# Altium project Genio350_DevKit.PrjPcb (part 2 of 3)

## Sheet LPDDR4X_Channel_A.SchDoc
size A4; SheetNumber: 14; SheetTotal: 36
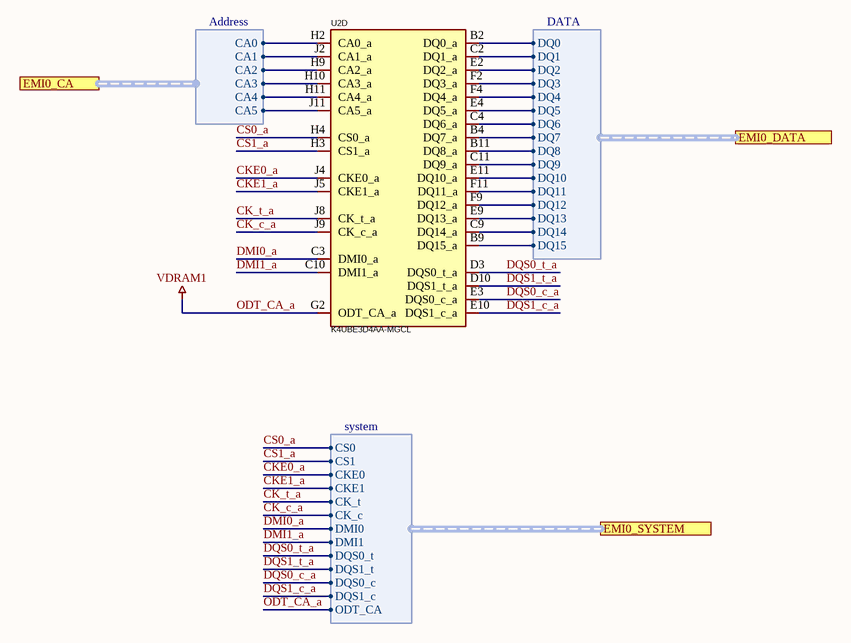
[diagram p11: LPDDR4X_Channel_A.SchDoc]

### Parts
U2  K4UBE3D4AA-MGCL  [K4F8E304HB-MGCJ]  (part D of 5)

### Ports
EMI0_CA (harness Address, see LPDDR4X[6000,9400], LPDDR4X[7000,9400], MT8365[2420,6400], MT8365_DDR4X[7500,5500]), EMI0_DATA (harness DATA, see LPDDR4X[6000,9820], LPDDR4X[7000,9820], MT8365[2294.4,6800], MT8365_DDR4X[7800,9200]), EMI0_SYSTEM (harness system, see LPDDR4X[6000,8860], LPDDR4X[7000,8860], MT8365[2200,5960], MT8365_DDR4X[8200,3000])

### Harnesses
DATA: DQ0, DQ1, DQ2, DQ3, DQ4, DQ5, DQ6, DQ7, DQ8, DQ9, DQ10, DQ11, DQ12, DQ13, DQ14, DQ15
Address: CA0, CA1, CA2, CA3, CA4, CA5
system: CS0, CS1, CKE0, CKE1, CK_t, CK_c, DMI0, DMI1, DQS0_t, DQS1_t, DQS0_c, DQS1_c, ODT_CA

### Nets
ODT_CA_a: U2.G2(ODT_CA_a) ; port EMI0_SYSTEM.ODT_CA  [also labelled VDRAM1]
CK_c_a: U2.J9(CK_c_a) ; port EMI0_SYSTEM.CK_c
CK_t_a: U2.J8(CK_t_a) ; port EMI0_SYSTEM.CK_t
CKE0_a: U2.J4(CKE0_a) ; port EMI0_SYSTEM.CKE0
CKE1_a: U2.J5(CKE1_a) ; port EMI0_SYSTEM.CKE1
CS0_a: U2.H4(CS0_a) ; port EMI0_SYSTEM.CS0
CS1_a: U2.H3(CS1_a) ; port EMI0_SYSTEM.CS1
DMI0_a: U2.C3(DMI0_a) ; port EMI0_SYSTEM.DMI0
DMI1_a: U2.C10(DMI1_a) ; port EMI0_SYSTEM.DMI1
DQS0_c_a: U2.E3(DQS0_c_a) ; port EMI0_SYSTEM.DQS0_c
DQS0_t_a: U2.D3(DQS0_t_a) ; port EMI0_SYSTEM.DQS0_t
DQS1_c_a: U2.E10(DQS1_c_a) ; port EMI0_SYSTEM.DQS1_c
DQS1_t_a: U2.D10(DQS1_t_a) ; port EMI0_SYSTEM.DQS1_t
EMI0_A3: U2.H11(CA4_a) ; port EMI0_CA.CA4
EMI0_A4: U2.H10(CA3_a) ; port EMI0_CA.CA3
EMI0_A12: U2.H9(CA2_a) ; port EMI0_CA.CA2
EMI0_ACT_N: U2.J2(CA1_a) ; port EMI0_CA.CA1
EMI0_BA0: U2.J11(CA5_a) ; port EMI0_CA.CA5
EMI0_DQ0: U2.E2(DQ2_a) ; port EMI0_DATA.DQ2
EMI0_DQ1: U2.B11(DQ8_a) ; port EMI0_DATA.DQ8
EMI0_DQ2: U2.E4(DQ5_a) ; port EMI0_DATA.DQ5
EMI0_DQ3: U2.E11(DQ10_a) ; port EMI0_DATA.DQ10
EMI0_DQ4: U2.F2(DQ3_a) ; port EMI0_DATA.DQ3
EMI0_DQ5: U2.C11(DQ9_a) ; port EMI0_DATA.DQ9
EMI0_DQ6: U2.F4(DQ4_a) ; port EMI0_DATA.DQ4
EMI0_DQ7: U2.F11(DQ11_a) ; port EMI0_DATA.DQ11
EMI0_DQ8: U2.B4(DQ7_a) ; port EMI0_DATA.DQ7
EMI0_DQ9: U2.F9(DQ12_a) ; port EMI0_DATA.DQ12
EMI0_DQ10: U2.C4(DQ6_a) ; port EMI0_DATA.DQ6
EMI0_DQ11: U2.E9(DQ13_a) ; port EMI0_DATA.DQ13
EMI0_DQ12: U2.B2(DQ0_a) ; port EMI0_DATA.DQ0
EMI0_DQ13: U2.C9(DQ14_a) ; port EMI0_DATA.DQ14
EMI0_DQ14: U2.C2(DQ1_a) ; port EMI0_DATA.DQ1
EMI0_DQ15: U2.B9(DQ15_a) ; port EMI0_DATA.DQ15
EMI0_ODT: U2.H2(CA0_a) ; port EMI0_CA.CA0

### Library data of the parts
U2 = K4UBE3D4AA-MGCL: Integrated Circuit; Manufacturer: SAMSUNG(三星半导体); Add into BOM: yes; Memory Format: SDRAM LPDDR4X; Clock Frequency (fc): 2133MHz; Memory Size: 32Gbit; Supply Voltage: 1.7V~1.95V; Symbol: K4UBE3D4AA-MGCL; Device: K4UBE3D4AA-MGCL; LCSC Part Name: K4UBE3D4AA-MGCL 停产; Supplier Part: C2920257; Manufacturer Part: K4UBE3D4AA-MGCL; Supplier Footprint: FBGA-200; JLCPCB Part Class: Extended Part; Datasheet: https://atta.szlcsc.com/upload/public/pdf/source/20231024/5530CB18C2033A14DEC9B3A35E728586.pdf; Supplier: LCSC; Convert to PCB: yes; Supply current: -; Refresh Current: -; Operating Temperature: -25℃~+85℃

## Sheet LPDDR4X_Channel_B.SchDoc
size A4; SheetNumber: 15; SheetTotal: 36
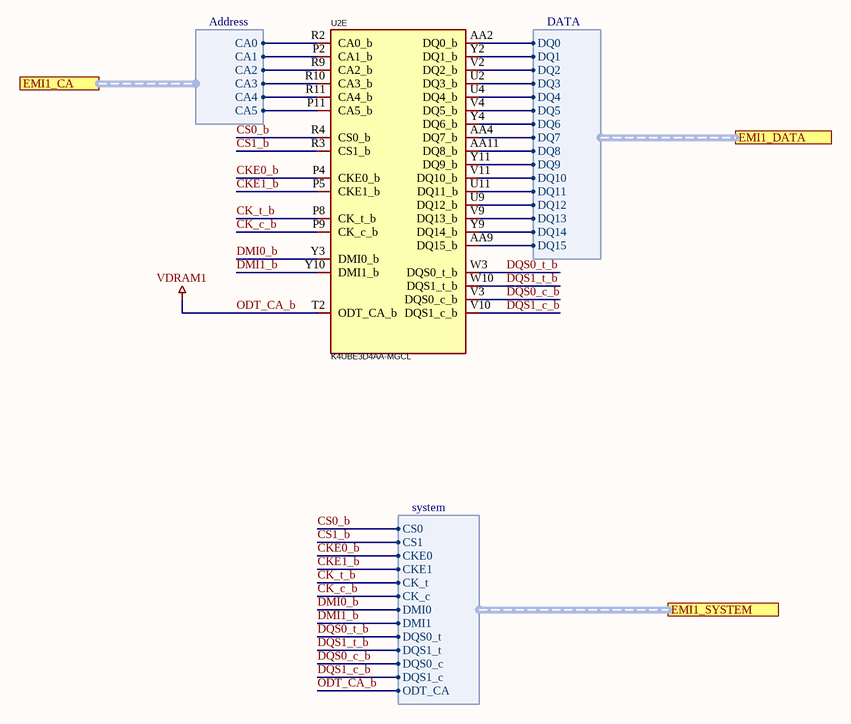
[diagram p12: LPDDR4X_Channel_B.SchDoc]

### Parts
U2  K4UBE3D4AA-MGCL  [K4F8E304HB-MGCJ]  (part E of 5)

### Ports
EMI1_CA (harness Address, see LPDDR4X[6000,7400], LPDDR4X[7020,7400], MT8365[2420,6200], MT8365_DDR4X[7500,4500]), EMI1_DATA (harness DATA, see LPDDR4X[6000,7900], LPDDR4X[7000,7900], MT8365[2300,6580], MT8365_DDR4X[7800,7200]), EMI1_SYSTEM (harness system, see LPDDR4X[6000,6900], LPDDR4X[7000,6900], MT8365[2200,5720], MT8365_DDR4X[8200,1300])

### Harnesses
DATA: DQ0, DQ1, DQ2, DQ3, DQ4, DQ5, DQ6, DQ7, DQ8, DQ9, DQ10, DQ11, DQ12, DQ13, DQ14, DQ15
Address: CA0, CA1, CA2, CA3, CA4, CA5
system: CS0, CS1, CKE0, CKE1, CK_t, CK_c, DMI0, DMI1, DQS0_t, DQS1_t, DQS0_c, DQS1_c, ODT_CA

### Nets
ODT_CA_b: U2.T2(ODT_CA_b) ; port EMI1_SYSTEM.ODT_CA  [also labelled VDRAM1]  [project net ODT_CA_a]
CK_c_b: U2.P9(CK_c_b) ; port EMI1_SYSTEM.CK_c
CK_t_b: U2.P8(CK_t_b) ; port EMI1_SYSTEM.CK_t
CKE0_b: U2.P4(CKE0_b) ; port EMI1_SYSTEM.CKE0
CKE1_b: U2.P5(CKE1_b) ; port EMI1_SYSTEM.CKE1
CS0_b: U2.R4(CS0_b) ; port EMI1_SYSTEM.CS0
CS1_b: U2.R3(CS1_b) ; port EMI1_SYSTEM.CS1
DMI0_b: U2.Y3(DMI0_b) ; port EMI1_SYSTEM.DMI0
DMI1_b: U2.Y10(DMI1_b) ; port EMI1_SYSTEM.DMI1
DQS0_c_b: U2.V3(DQS0_c_b) ; port EMI1_SYSTEM.DQS0_c
DQS0_t_b: U2.W3(DQS0_t_b) ; port EMI1_SYSTEM.DQS0_t
DQS1_c_b: U2.V10(DQS1_c_b) ; port EMI1_SYSTEM.DQS1_c
DQS1_t_b: U2.W10(DQS1_t_b) ; port EMI1_SYSTEM.DQS1_t
EMI1_A0: U2.R11(CA4_b) ; port EMI1_CA.CA4
EMI1_A1: U2.R10(CA3_b) ; port EMI1_CA.CA3
EMI1_A3: U2.R9(CA2_b) ; port EMI1_CA.CA2
EMI1_A5: U2.P11(CA5_b) ; port EMI1_CA.CA5
EMI1_ACT_N: U2.R2(CA0_b) ; port EMI1_CA.CA0
EMI1_DQ0: U2.U9(DQ12_b) ; port EMI1_DATA.DQ12
EMI1_DQ1: U2.Y2(DQ1_b) ; port EMI1_DATA.DQ1
EMI1_DQ2: U2.Y9(DQ14_b) ; port EMI1_DATA.DQ14
EMI1_DQ3: U2.Y4(DQ6_b) ; port EMI1_DATA.DQ6
EMI1_DQ4: U2.V9(DQ13_b) ; port EMI1_DATA.DQ13
EMI1_DQ5: U2.AA2(DQ0_b) ; port EMI1_DATA.DQ0
EMI1_DQ6: U2.AA9(DQ15_b) ; port EMI1_DATA.DQ15
EMI1_DQ7: U2.AA4(DQ7_b) ; port EMI1_DATA.DQ7
EMI1_DQ8: U2.U11(DQ11_b) ; port EMI1_DATA.DQ11
EMI1_DQ9: U2.V2(DQ2_b) ; port EMI1_DATA.DQ2
EMI1_DQ10: U2.V11(DQ10_b) ; port EMI1_DATA.DQ10
EMI1_DQ11: U2.U2(DQ3_b) ; port EMI1_DATA.DQ3
EMI1_DQ12: U2.Y11(DQ9_b) ; port EMI1_DATA.DQ9
EMI1_DQ13: U2.V4(DQ5_b) ; port EMI1_DATA.DQ5
EMI1_DQ14: U2.AA11(DQ8_b) ; port EMI1_DATA.DQ8
EMI1_DQ15: U2.U4(DQ4_b) ; port EMI1_DATA.DQ4
EMI1_ODT: U2.P2(CA1_b) ; port EMI1_CA.CA1

### Library data of the parts
U2 = K4UBE3D4AA-MGCL: as U2 on sheet LPDDR4X_Channel_A; Symbol: K4UBE3D4AA-MGCL; Device: K4UBE3D4AA-MGCL; LCSC Part Name: K4UBE3D4AA-MGCL 停产; Supplier Part: C2920257; Manufacturer Part: K4UBE3D4AA-MGCL; Supplier Footprint: FBGA-200; JLCPCB Part Class: Extended Part; Datasheet: https://atta.szlcsc.com/upload/public/pdf/source/20231024/5530CB18C2033A14DEC9B3A35E728586.pdf; Supplier: LCSC; Convert to PCB: yes; Supply current: -; Refresh Current: -; Operating Temperature: -25℃~+85℃

## Sheet LPDDR4X_Power.SchDoc
size A3; SheetNumber: 13; SheetTotal: 36
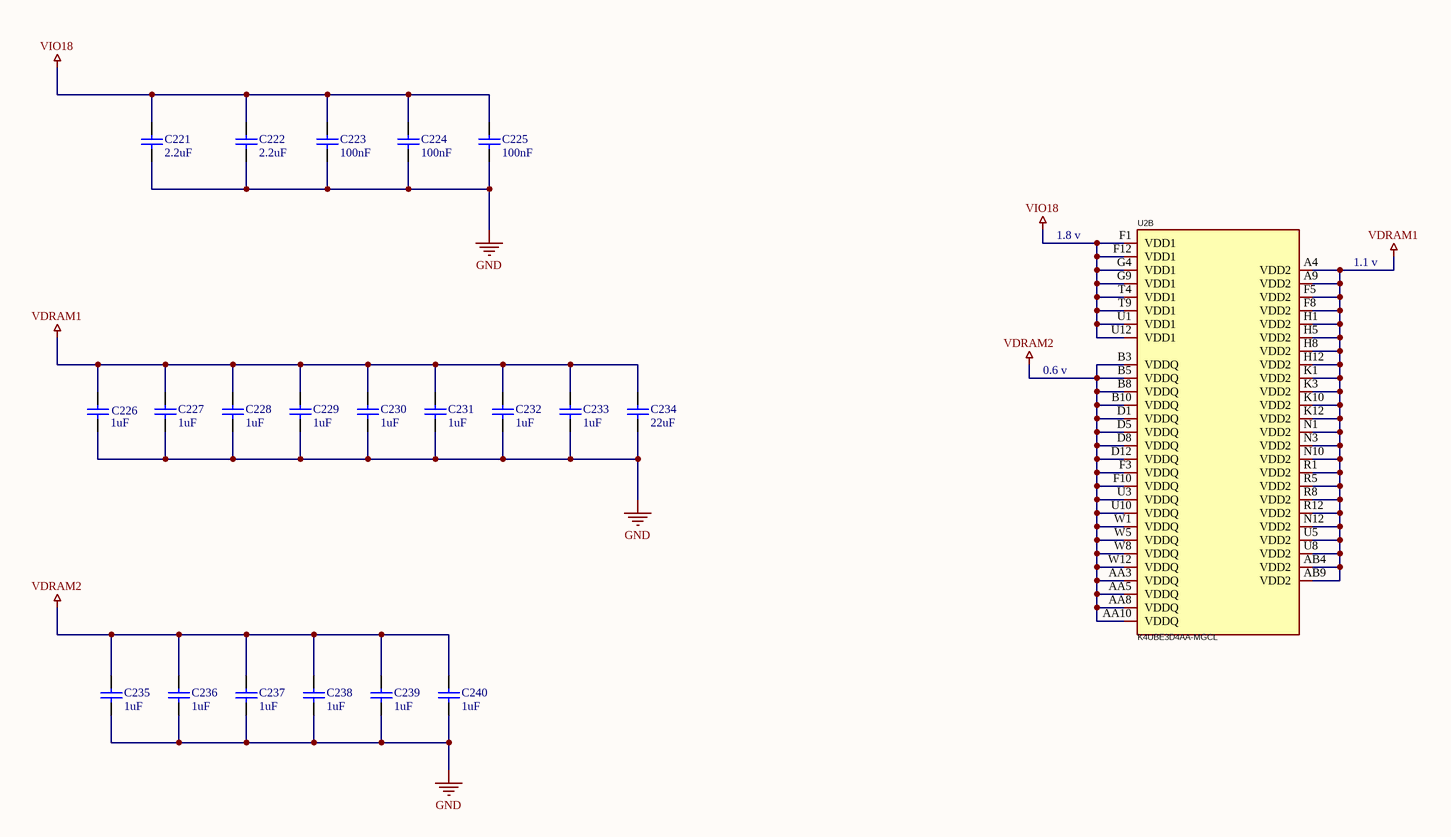
[diagram p13: LPDDR4X_Power.SchDoc]

### Parts
C221  value 2.2uF  [C0805]  (hidden comment: C0805)
C222  value 2.2uF  [C0805]  (hidden comment: C0805)
C223  value 100nF  [C0603]  (hidden comment: C0603)
C224  value 100nF  [C0603]  (hidden comment: C0603)
C225  value 100nF  [C0603]  (hidden comment: C0603)
C226  value 1uF  [C0805]  (hidden comment: C0805)
C227  value 1uF  [C0805]  (hidden comment: C0805)
C228  value 1uF  [C0805]  (hidden comment: C0805)
C229  value 1uF  [C0805]  (hidden comment: C0805)
C230  value 1uF  [C0805]  (hidden comment: C0805)
C231  value 1uF  [C0805]  (hidden comment: C0805)
C232  value 1uF  [C0805]  (hidden comment: C0805)
C233  value 1uF  [C0805]  (hidden comment: C0805)
C234  value 22uF  [C1210]  (hidden comment: C1210)
C235  value 1uF  [C0805]  (hidden comment: C0805)
C236  value 1uF  [C0805]  (hidden comment: C0805)
C237  value 1uF  [C0805]  (hidden comment: C0805)
C238  value 1uF  [C0805]  (hidden comment: C0805)
C239  value 1uF  [C0805]  (hidden comment: C0805)
C240  value 1uF  [C0805]  (hidden comment: C0805)
U2  K4UBE3D4AA-MGCL  [K4F8E304HB-MGCJ]  (part B of 5)

### Nets
GND: C221.1 C222.1 C223.1 C224.1 C225.1 C226.1 C227.1 C228.1 C229.1 C230.1 C231.1 C232.1 C233.1 C234.1 C235.1 C236.1 C237.1 C238.1 C239.1 C240.1
VDRAM1: C226.2 C227.2 C228.2 C229.2 C230.2 C231.2 C232.2 C233.2 C234.2 U2.A4(VDD2) U2.A9(VDD2) U2.AB4(VDD2) U2.AB9(VDD2) U2.F5(VDD2) U2.F8(VDD2) U2.H1(VDD2) U2.H5(VDD2) U2.H8(VDD2) U2.H12(VDD2) U2.K1(VDD2) U2.K3(VDD2) U2.K10(VDD2) U2.K12(VDD2) U2.N1(VDD2) U2.N3(VDD2) U2.N10(VDD2) U2.N12(VDD2) U2.R1(VDD2) U2.R5(VDD2) U2.R8(VDD2) U2.R12(VDD2) U2.U5(VDD2) U2.U8(VDD2)  [project net ODT_CA_a]
VDRAM2: C235.2 C236.2 C237.2 C238.2 C239.2 C240.2 U2.AA3(VDDQ) U2.AA5(VDDQ) U2.AA8(VDDQ) U2.AA10(VDDQ) U2.B3(VDDQ) U2.B5(VDDQ) U2.B8(VDDQ) U2.B10(VDDQ) U2.D1(VDDQ) U2.D5(VDDQ) U2.D8(VDDQ) U2.D12(VDDQ) U2.F3(VDDQ) U2.F10(VDDQ) U2.U3(VDDQ) U2.U10(VDDQ) U2.W1(VDDQ) U2.W5(VDDQ) U2.W8(VDDQ) U2.W12(VDDQ)
VIO18: C221.2 C222.2 C223.2 C224.2 C225.2 U2.F1(VDD1) U2.F12(VDD1) U2.G4(VDD1) U2.G9(VDD1) U2.T4(VDD1) U2.T9(VDD1) U2.U1(VDD1) U2.U12(VDD1)

### Notes on the sheet
- (near U2) 1.8 v
- 1.1 v
- 0.6 v

### Library data of the parts
U2 = K4UBE3D4AA-MGCL: Manufacturer: SAMSUNG(三星半导体); Add into BOM: yes; Memory Format: SDRAM LPDDR4X; Clock Frequency (fc): 2133MHz; Memory Size: 32Gbit; Supply Voltage: 1.7V~1.95V; Symbol: K4UBE3D4AA-MGCL; Device: K4UBE3D4AA-MGCL; LCSC Part Name: K4UBE3D4AA-MGCL 停产; Supplier Part: C2920257; Manufacturer Part: K4UBE3D4AA-MGCL; Supplier Footprint: FBGA-200; JLCPCB Part Class: Extended Part; Datasheet: https://atta.szlcsc.com/upload/public/pdf/source/20231024/5530CB18C2033A14DEC9B3A35E728586.pdf; Supplier: LCSC; Convert to PCB: yes; Supply current: -; Refresh Current: -; Operating Temperature: -25℃~+85℃

## Sheet LPDDR4X_Ground.SchDoc
size A4; SheetNumber: 12; SheetTotal: 32
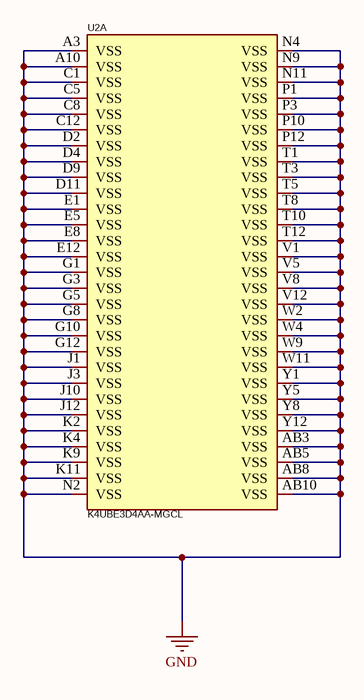
[diagram p14: LPDDR4X_Ground.SchDoc]

### Parts
U2  K4UBE3D4AA-MGCL  [K4F8E304HB-MGCJ]  (part A of 5)

### Nets
GND: U2.A3(VSS) U2.A10(VSS) U2.AB3(VSS) U2.AB5(VSS) U2.AB8(VSS) U2.AB10(VSS) U2.C1(VSS) U2.C5(VSS) U2.C8(VSS) U2.C12(VSS) U2.D2(VSS) U2.D4(VSS) U2.D9(VSS) U2.D11(VSS) U2.E1(VSS) U2.E5(VSS) U2.E8(VSS) U2.E12(VSS) U2.G1(VSS) U2.G3(VSS) U2.G5(VSS) U2.G8(VSS) U2.G10(VSS) U2.G12(VSS) U2.J1(VSS) U2.J3(VSS) U2.J10(VSS) U2.J12(VSS) U2.K2(VSS) U2.K4(VSS) U2.K9(VSS) U2.K11(VSS) U2.N2(VSS) U2.N4(VSS) U2.N9(VSS) U2.N11(VSS) U2.P1(VSS) U2.P3(VSS) U2.P10(VSS) U2.P12(VSS) U2.T1(VSS) U2.T3(VSS) U2.T5(VSS) U2.T8(VSS) U2.T10(VSS) U2.T12(VSS) U2.V1(VSS) U2.V5(VSS) U2.V8(VSS) U2.V12(VSS) U2.W2(VSS) U2.W4(VSS) U2.W9(VSS) U2.W11(VSS) U2.Y1(VSS) U2.Y5(VSS) U2.Y8(VSS) U2.Y12(VSS)

### Library data of the parts
U2 = K4UBE3D4AA-MGCL: as U2 on sheet LPDDR4X_Power; Symbol: K4UBE3D4AA-MGCL; Device: K4UBE3D4AA-MGCL; LCSC Part Name: K4UBE3D4AA-MGCL 停产; Supplier Part: C2920257; Manufacturer Part: K4UBE3D4AA-MGCL; Supplier Footprint: FBGA-200; JLCPCB Part Class: Extended Part; Datasheet: https://atta.szlcsc.com/upload/public/pdf/source/20231024/5530CB18C2033A14DEC9B3A35E728586.pdf; Supplier: LCSC; Convert to PCB: yes; Supply current: -; Refresh Current: -; Operating Temperature: -25℃~+85℃

## Sheet LPDDR4X_other.SchDoc
size A4; SheetNumber: 16; SheetTotal: 36
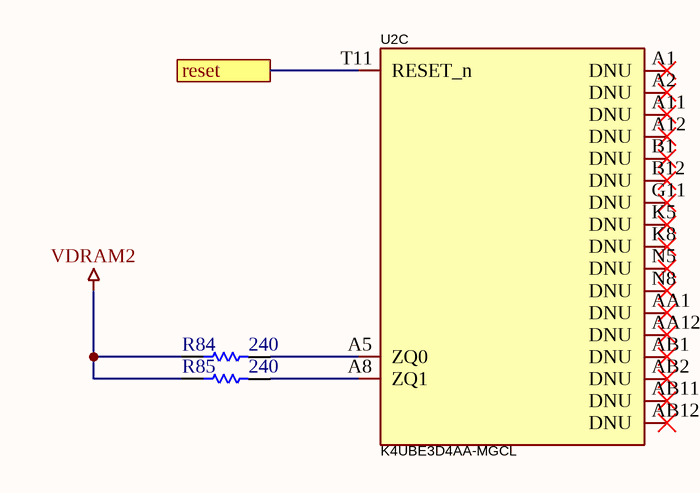
[diagram p15: LPDDR4X_other.SchDoc]

### Parts
R84  value 240  [R0603]  (hidden comment: R0603)
R85  value 240  [R0603]  (hidden comment: R0603)
U2  K4UBE3D4AA-MGCL  [K4F8E304HB-MGCJ]  (part C of 5)

### Ports
reset (see LPDDR4X[6000,2000], LPDDR4X[7000,2000], MT8365_LPDDR4X[880,4800])

### Nets
VDRAM2: R84.1 R85.1
NetR84_2: R84.2 U2.A5(ZQ0)
NetR85_2: R85.2 U2.A8(ZQ1)
NetU1#1_F14: U2.T11(RESET_n) ; port reset

Not connected (* = marked no-connect by the designer): U2 A1(DNU)* A2(DNU)* A11(DNU)* A12(DNU)* AA1(DNU)* AA12(DNU)* AB1(DNU)* AB2(DNU)* AB11(DNU)* AB12(DNU)* B1(DNU)* B12(DNU)* G11(DNU)* K5(DNU)* K8(DNU)* N5(DNU)* N8(DNU)*

### Library data of the parts
U2 = K4UBE3D4AA-MGCL: as U2 on sheet LPDDR4X_Power; Symbol: K4UBE3D4AA-MGCL; Device: K4UBE3D4AA-MGCL; LCSC Part Name: K4UBE3D4AA-MGCL 停产; Supplier Part: C2920257; Manufacturer Part: K4UBE3D4AA-MGCL; Supplier Footprint: FBGA-200; JLCPCB Part Class: Extended Part; Datasheet: https://atta.szlcsc.com/upload/public/pdf/source/20231024/5530CB18C2033A14DEC9B3A35E728586.pdf; Supplier: LCSC; Convert to PCB: yes; Supply current: -; Refresh Current: -; Operating Temperature: -25℃~+85℃

## Sheet eMMC.SchDoc
size A3; Author: Nguyễn Hữu Thắng; DrawnBy: Nguyễn Hữu Thắng; SheetNumber: 17; SheetTotal: 36
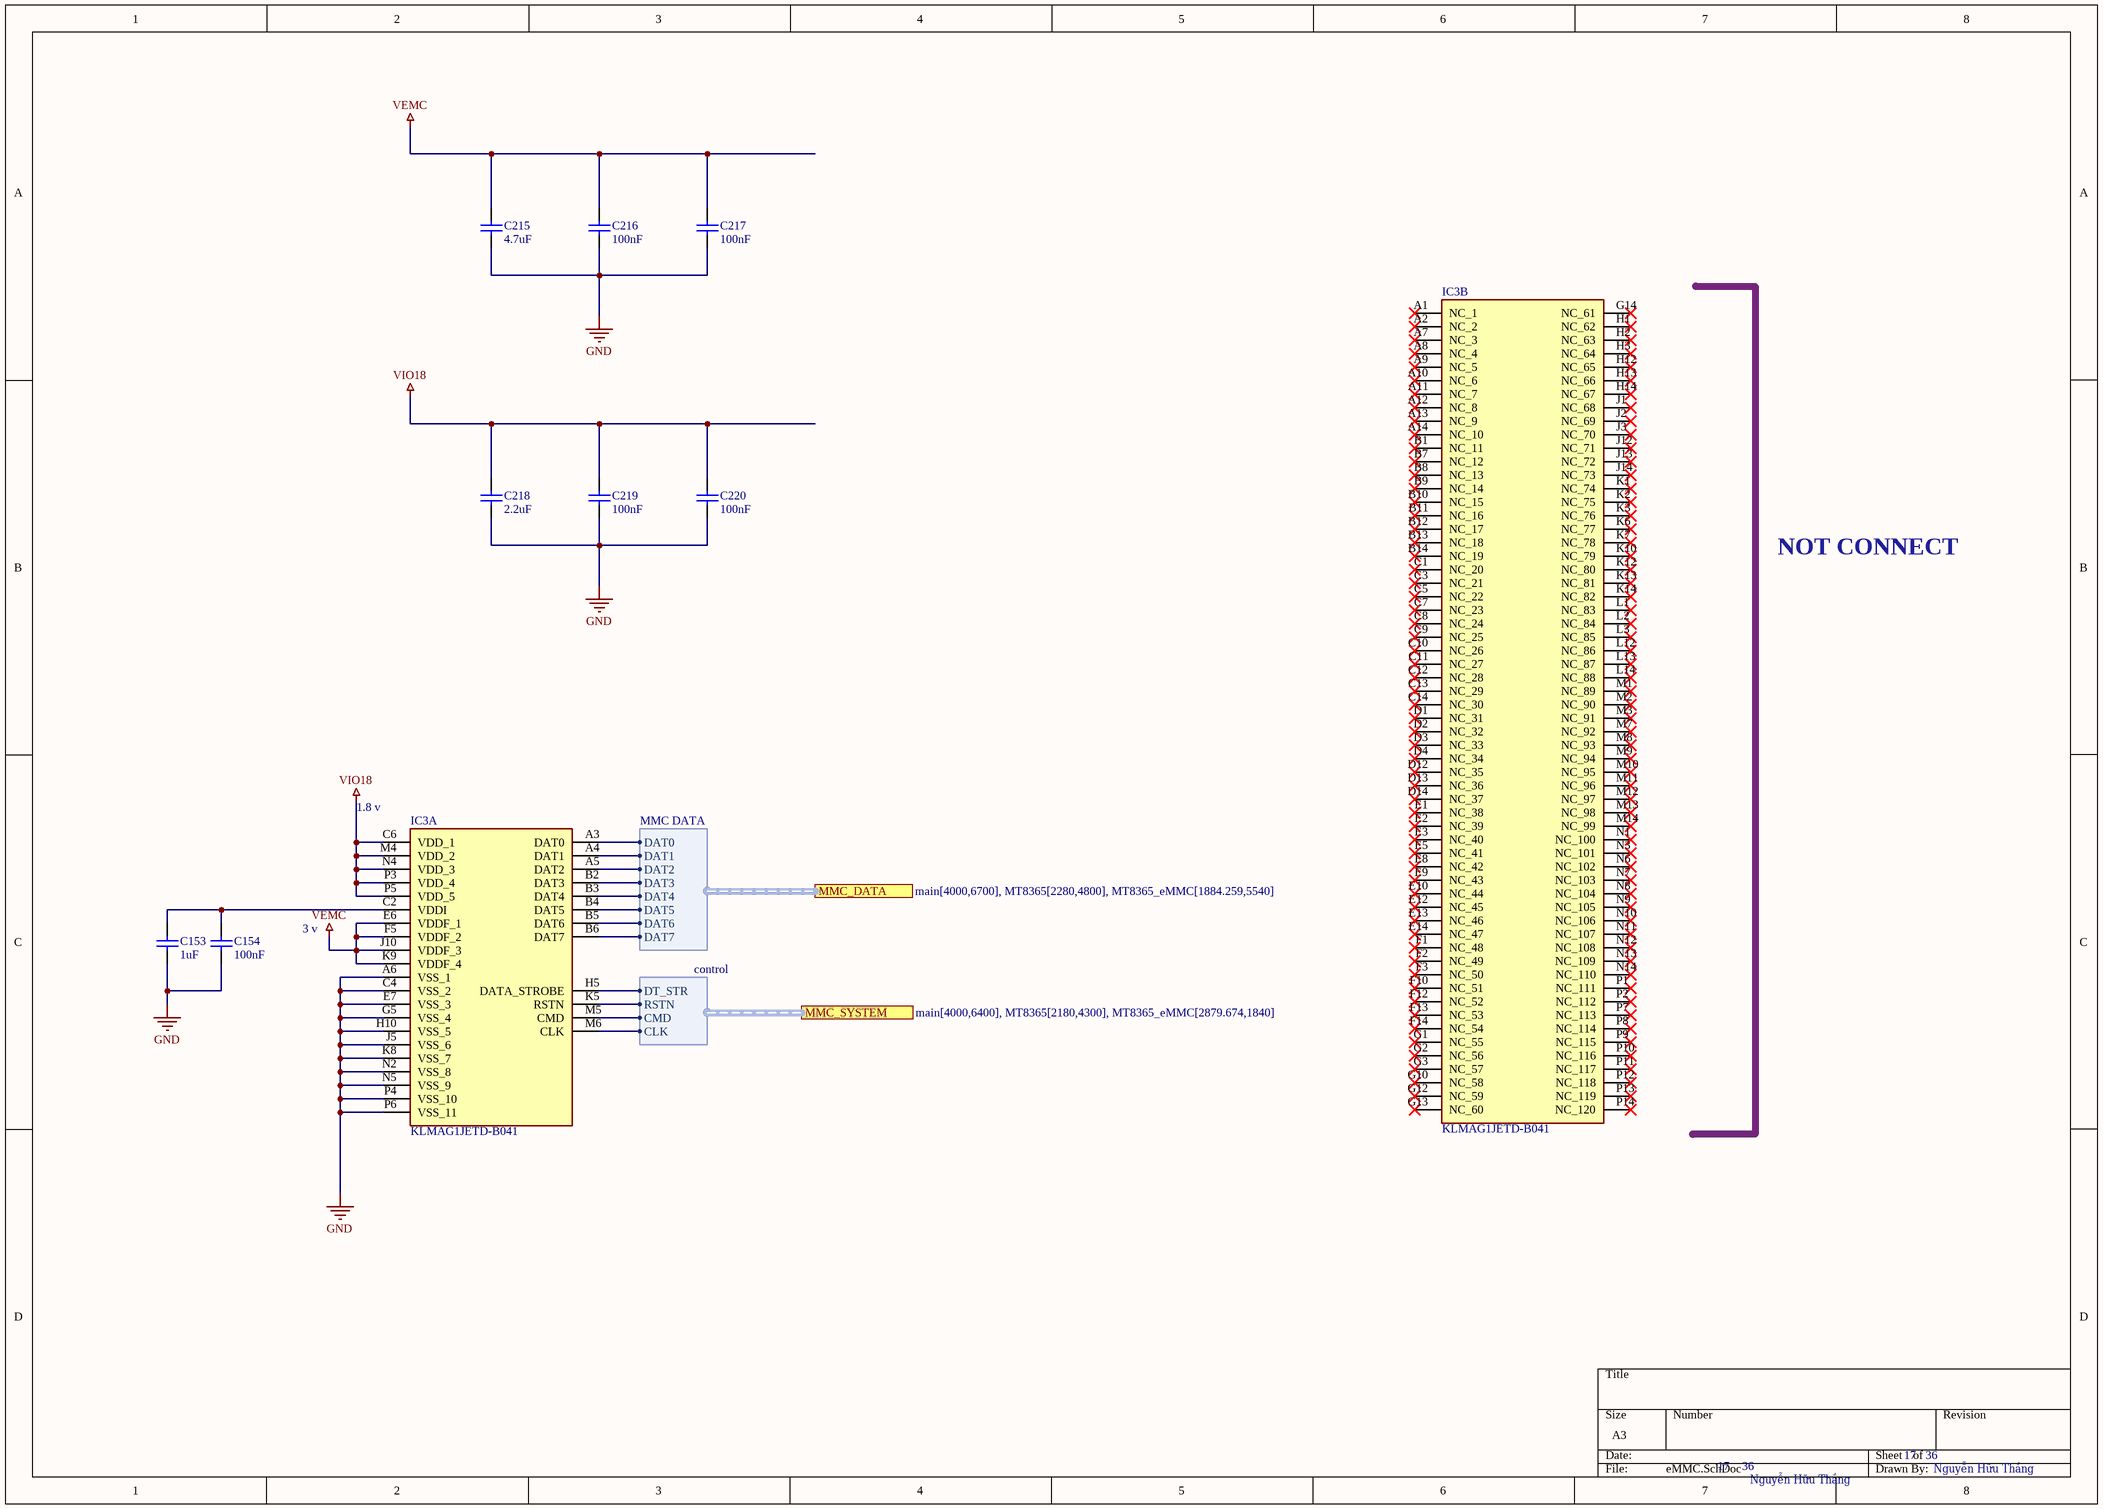
[diagram p16: eMMC.SchDoc]

### Parts
C153  value 1uF  [C0805]  (hidden comment: C0805)
C154  value 100nF  [C0603]  (hidden comment: C0603)
C215  value 4.7uF  [C0805]  (hidden comment: C0805)
C216  value 100nF  [C0603]  (hidden comment: C0603)
C217  value 100nF  [C0603]  (hidden comment: C0603)
C218  value 2.2uF  [C0805]  (hidden comment: C0805)
C219  value 100nF  [C0603]  (hidden comment: C0603)
C220  value 100nF  [C0603]  (hidden comment: C0603)
IC3  KLMAG1JETD-B041  [BGA153C50P14X14_1150X1300X80]  (parts A,B of 2)

### Ports
MMC_DATA (harness MMC DATA, see main[4000,6700], MT8365[2280,4800], MT8365_eMMC[1884.259,5540]), MMC_SYSTEM (harness control, see main[4000,6400], MT8365[2180,4300], MT8365_eMMC[2879.674,1840])

### Harnesses
MMC DATA: DAT0, DAT1, DAT2, DAT3, DAT4, DAT5, DAT6, DAT7
control: DT_STR, RSTN, CMD, CLK

### Nets
GND: C153.1 C154.1 C215.1 C216.1 C217.1 C218.1 C219.1 C220.1 IC3.A6(VSS_1) IC3.C4(VSS_2) IC3.E7(VSS_3) IC3.G5(VSS_4) IC3.H10(VSS_5) IC3.J5(VSS_6) IC3.K8(VSS_7) IC3.N2(VSS_8) IC3.N5(VSS_9) IC3.P4(VSS_10) IC3.P6(VSS_11)
VEMC: C215.2 C216.2 C217.2 IC3.E6(VDDF_1) IC3.F5(VDDF_2) IC3.J10(VDDF_3) IC3.K9(VDDF_4)
VIO18: C218.2 C219.2 C220.2 IC3.C6(VDD_1) IC3.M4(VDD_2) IC3.N4(VDD_3) IC3.P3(VDD_4) IC3.P5(VDD_5)
CLK: IC3.M6(CLK) ; port MMC_SYSTEM.CLK
CMD: IC3.M5(CMD) ; port MMC_SYSTEM.CMD
DSL: IC3.H5(DATA_STROBE) ; port MMC_SYSTEM.DT_STR
RSTB: IC3.K5(RSTN) ; port MMC_SYSTEM.RSTN
NetC153_2: C153.2 C154.2 IC3.C2(VDDI)
NetIC3_A3: IC3.A3(DAT0) ; port MMC_DATA.DAT0
NetIC3_A4: IC3.A4(DAT1) ; port MMC_DATA.DAT1
NetIC3_A5: IC3.A5(DAT2) ; port MMC_DATA.DAT2
NetIC3_B2: IC3.B2(DAT3) ; port MMC_DATA.DAT3
NetIC3_B3: IC3.B3(DAT4) ; port MMC_DATA.DAT4
NetIC3_B4: IC3.B4(DAT5) ; port MMC_DATA.DAT5
NetIC3_B5: IC3.B5(DAT6) ; port MMC_DATA.DAT6
NetIC3_B6: IC3.B6(DAT7) ; port MMC_DATA.DAT7

Not connected (* = marked no-connect by the designer): IC3 A1(NC_1)* A2(NC_2)* A7(NC_3)* A8(NC_4)* A9(NC_5)* A10(NC_6)* A11(NC_7)* A12(NC_8)* A13(NC_9)* A14(NC_10)* B1(NC_11)* B7(NC_12)* B8(NC_13)* B9(NC_14)* B10(NC_15)* B11(NC_16)* B12(NC_17)* B13(NC_18)* B14(NC_19)* C1(NC_20)* C3(NC_21)* C5(NC_22)* C7(NC_23)* C8(NC_24)* C9(NC_25)* C10(NC_26)* C11(NC_27)* C12(NC_28)* C13(NC_29)* C14(NC_30)* D1(NC_31)* D2(NC_32)* D3(NC_33)* D4(NC_34)* D12(NC_35)* D13(NC_36)* D14(NC_37)* E1(NC_38)* E2(NC_39)* E3(NC_40)* E5(NC_41)* E8(NC_42)* E9(NC_43)* E10(NC_44)* E12(NC_45)* E13(NC_46)* E14(NC_47)* F1(NC_48)* F2(NC_49)* F3(NC_50)* F10(NC_51)* F12(NC_52)* F13(NC_53)* F14(NC_54)* G1(NC_55)* G2(NC_56)* G3(NC_57)* G10(NC_58)* G12(NC_59)* G13(NC_60)* G14(NC_61)* H1(NC_62)* H2(NC_63)* H3(NC_64)* H12(NC_65)* H13(NC_66)* H14(NC_67)* J1(NC_68)* J2(NC_69)* J3(NC_70)* J12(NC_71)* J13(NC_72)* J14(NC_73)* K1(NC_74)* K2(NC_75)* K3(NC_76)* K6(NC_77)* K7(NC_78)* K10(NC_79)* K12(NC_80)* K13(NC_81)* K14(NC_82)* L1(NC_83)* L2(NC_84)* L3(NC_85)* L12(NC_86)* L13(NC_87)* L14(NC_88)* M1(NC_89)* M2(NC_90)* M3(NC_91)* M7(NC_92)* M8(NC_93)* M9(NC_94)* M10(NC_95)* M11(NC_96)* M12(NC_97)* M13(NC_98)* M14(NC_99)* N1(NC_100)* N3(NC_101)* N6(NC_102)* N7(NC_103)* N8(NC_104)* N9(NC_105)* N10(NC_106)* N11(NC_107)* N12(NC_108)* N13(NC_109)* N14(NC_110)* P1(NC_111)* P2(NC_112)* P7(NC_113)* P8(NC_114)* P9(NC_115)* P10(NC_116)* P11(NC_117)* P12(NC_118)* P13(NC_119)* P14(NC_120)*

### Notes on the sheet
- NOT CONNECT
- (near IC3) 1.8 v
- 3 v

### Library data of the parts
IC3 = KLMAG1JETD-B041: Integrated Circuit; Manufacturer_Name: SAMSUNG; Datasheet Link: https://datasheet.lcsc.com/lcsc/2007011825_Samsung-KLMAG1JETD-B041_C499919.pdf; Height: 0.8mm; Manufacturer_Part_Number: KLMAG1JETD-B041

## Sheet MT6631.SchDoc
size A3; SheetNumber: 26; SheetTotal: 36
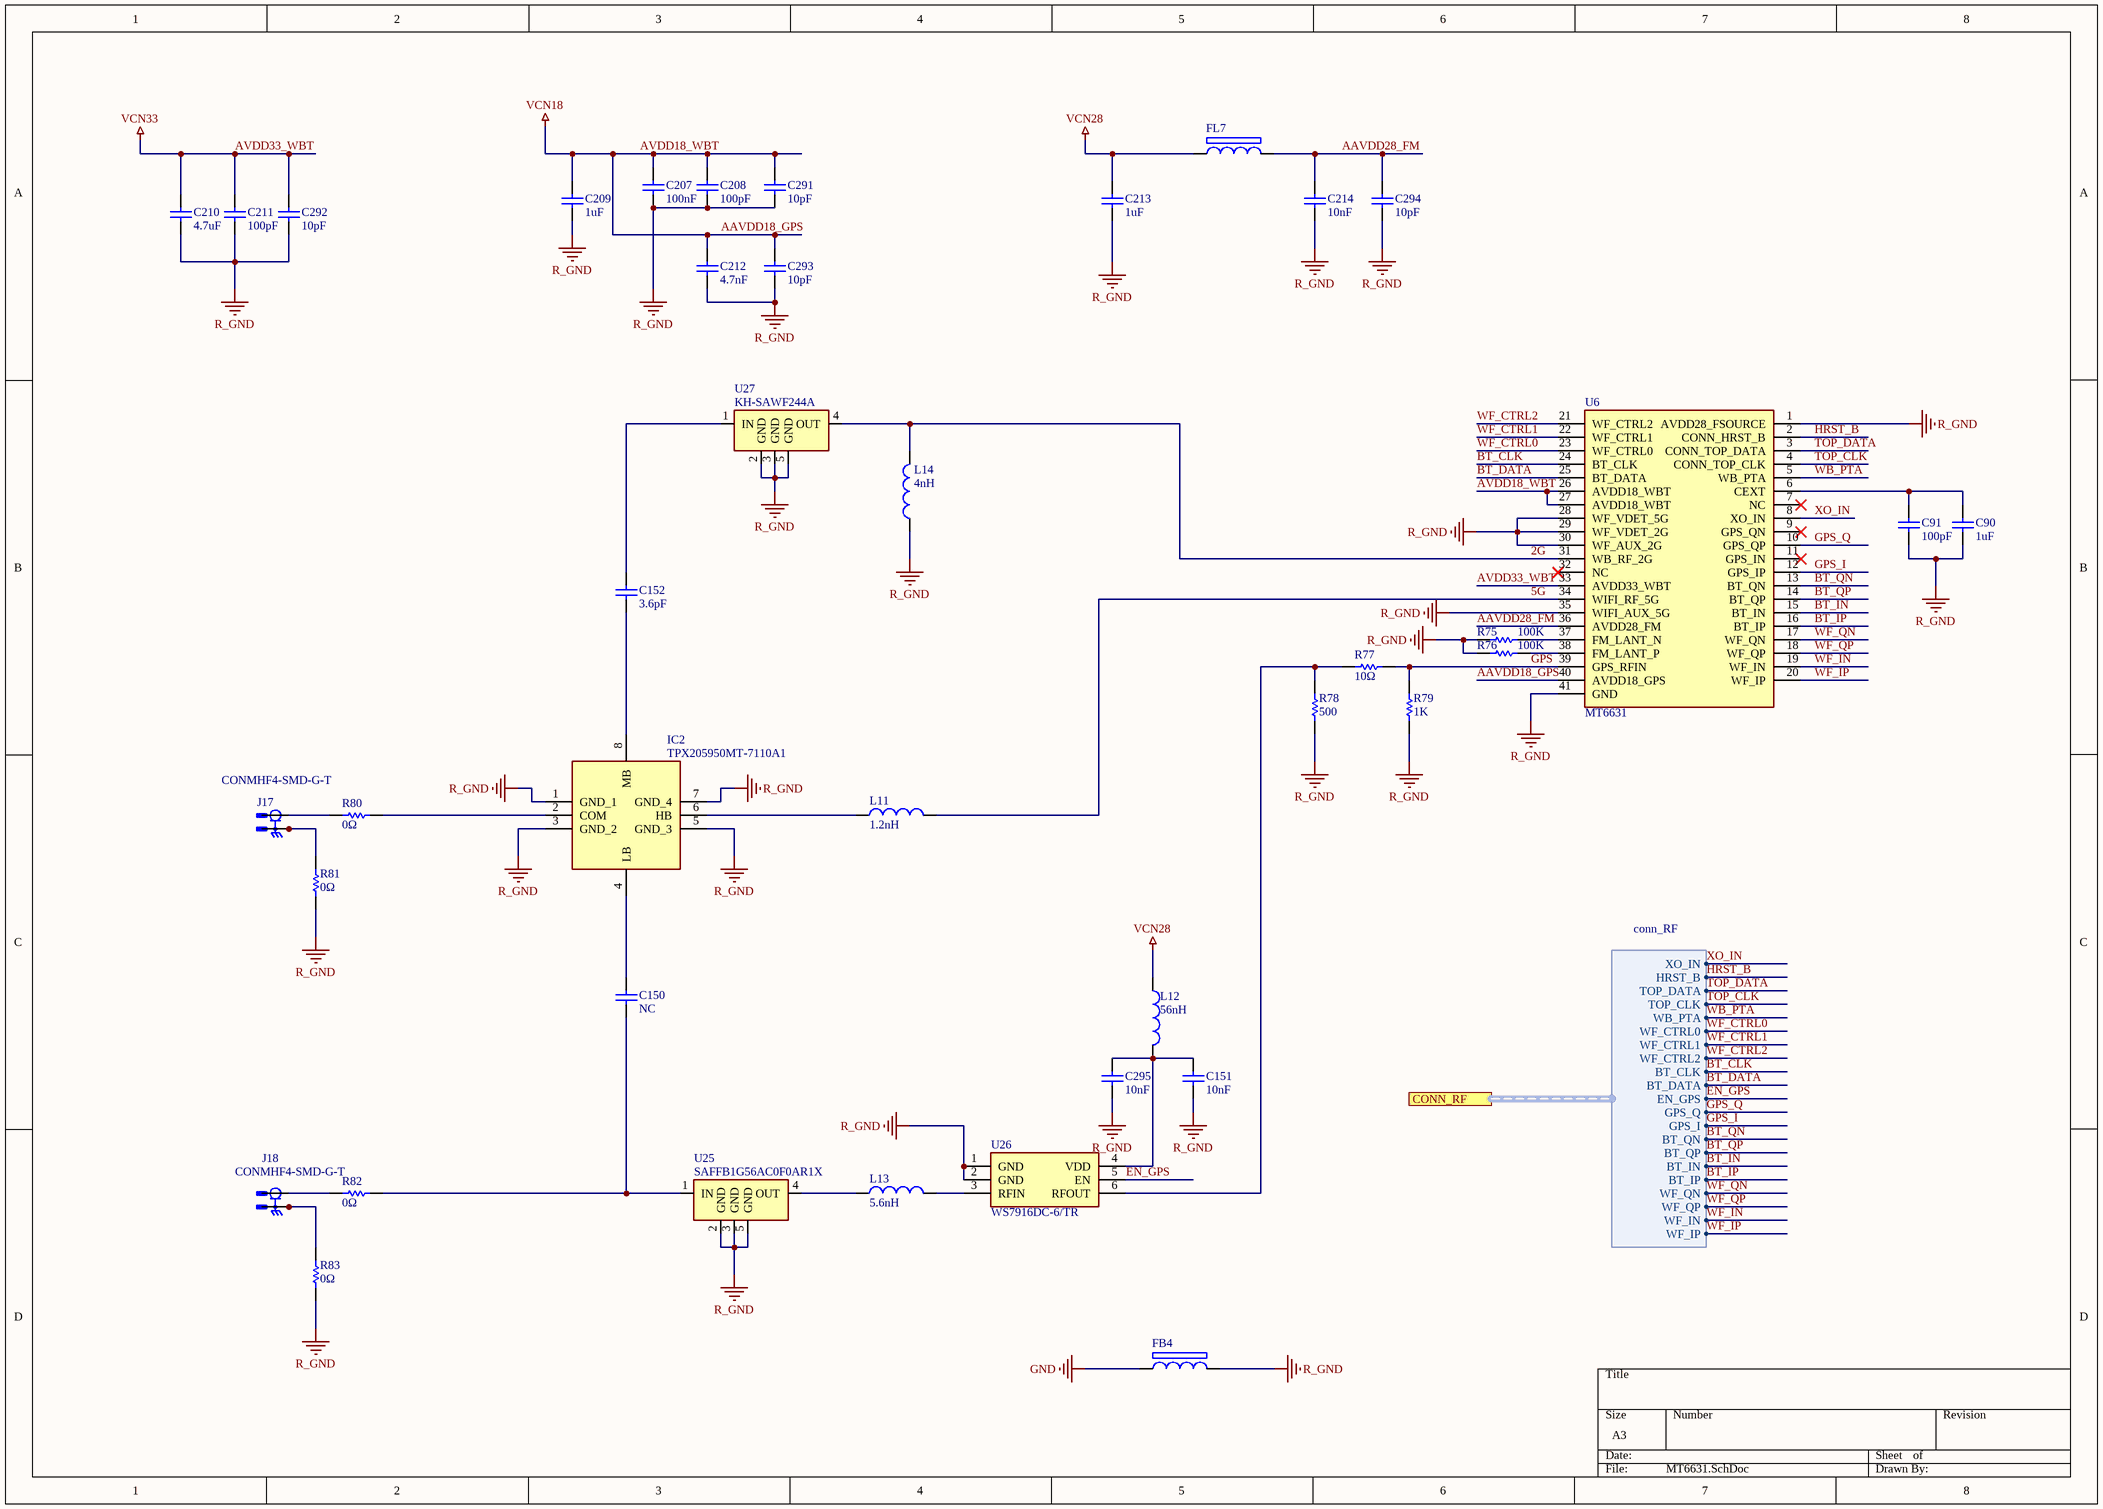
[diagram p17: MT6631.SchDoc]

### Parts
C90  value 1uF  [C0805]  (hidden comment: C0805)
C91  value 100pF  [C0402]  (hidden comment: C0402)
C150  value NC  [C0402]  (hidden comment: C0402)
C151  value 10nF  [C0603]  (hidden comment: C0603)
C152  value 3.6pF  [C0402]  (hidden comment: C0402)
C207  value 100nF  [C0603]  (hidden comment: C0603)
C208  value 100pF  [C0402]  (hidden comment: C0402)
C209  value 1uF  [C0805]  (hidden comment: C0805)
C210  value 4.7uF  [C0805]  (hidden comment: C0805)
C211  value 100pF  [C0402]  (hidden comment: C0402)
C212  value 4.7nF  [C0603]  (hidden comment: C0603)
C213  value 1uF  [C0805]  (hidden comment: C0805)
C214  value 10nF  [C0603]  (hidden comment: C0603)
C291  value 10pF  [C0402]  (hidden comment: C0402)
C292  value 10pF  [C0402]  (hidden comment: C0402)
C293  value 10pF  [C0402]  (hidden comment: C0402)
C294  value 10pF  [C0402]  (hidden comment: C0402)
C295  value 10nF  [C0603]  (hidden comment: C0603)
FB4  BLM18KG121TN1D  [BLM18EG101TH1D]  (value not drawn)
FL7  BLM18BD252SN1D  [BEADC1608X95N]  (value not drawn)
IC2  TPX205950MT-7110A1  [TPX205950MT7110A1]
J17  CONMHF4-SMD-G-T  [LINX_CONMHF4-SMD-G-T]
J18  CONMHF4-SMD-G-T  [LINX_CONMHF4-SMD-G-T]
L11  value 1.2nH  [L0402]  (hidden comment: L0402)
L12  value 56nH  [L0402]  (hidden comment: L0402)
L13  value 5.6nH  [L0402]  (hidden comment: L0402)
L14  value 4nH  [L0402]  (hidden comment: L0402)
R75  value 100K  [R0603]  (hidden comment: R0603)
R76  value 100K  [R0603]  (hidden comment: R0603)
R77  value 10Ω  [R0603]  (hidden comment: R0603)
R78  value 500  [R0603]  (hidden comment: R0603)
R79  value 1K  [R0603]  (hidden comment: R0603)
R80  value 0Ω  [R0603]  (hidden comment: R0603)
R81  value 0Ω  [R0603]  (hidden comment: R0603)
R82  value 0Ω  [R0603]  (hidden comment: R0603)
R83  value 0Ω  [R0603]  (hidden comment: R0603)
U6  MT6631  [MT6631]
U25  SAFFB1G56AC0F0AR1X  [SAFFB1G56AC0F0AR1X]
U26  WS7916DC-6/TR  [WS7916DC-6/TR]
U27  KH-SAWF244A  [KH-SAWF244A]

### Ports
CONN_RF (harness conn_RF, see main[4000,4600], MT8365[5700,9000], MT8365_CONN[700,7400])

### Harnesses
conn_RF: XO_IN, HRST_B, TOP_DATA, TOP_CLK, WB_PTA, WF_CTRL0, WF_CTRL1, WF_CTRL2, BT_CLK, BT_DATA, GPS_Q, GPS_I, BT_QN, BT_QP, BT_IN, BT_IP, WF_QN, WF_QP, WF_IN, WF_IP, EN_GPS

### Nets
AAVDD18_GPS: C207.2 C208.2 C209.2 C212.2 C291.2 C293.2 U6.26(AVDD18_WBT) U6.27(AVDD18_WBT) U6.40(AVDD18_GPS)  [also labelled AVDD18_WBT, VCN18]
AVDD33_WBT: C210.2 C211.2 C292.2 U6.33(AVDD33_WBT)  [also labelled VCN33]
GND: FB4.1
R_GND: C90.1 C91.1 C151.1 C207.1 C208.1 C209.1 C210.1 C211.1 C212.1 C213.1 C214.1 C291.1 C292.1 C293.1 C294.1 C295.1 FB4.2 IC2.1(GND_1) IC2.3(GND_2) IC2.5(GND_3) IC2.7(GND_4) L14.1 R75.1 R76.1 R78.1 R79.1 R81.1 R83.1 U6.1(AVDD28_FSOURCE) U6.28(WF_VDET_5G) U6.29(WF_VDET_2G) U6.30(WF_AUX_2G) U6.35(WIFI_AUX_5G) U6.41(GND) U25.2(GND) U25.3(GND) U25.5(GND) U26.1(GND) U26.2(GND) U27.2(GND) U27.3(GND) U27.5(GND)
VCN28: C213.2 FL7.1 L12.1
2G: L14.2 U6.31(WB_RF_2G) U27.4(OUT)
5G: L11.2 U6.34(WIFI_RF_5G)
AAVDD28_FM: C214.2 C294.2 FL7.2 U6.36(AVDD28_FM)
BT_CLK: U6.24(BT_CLK) ; port CONN_RF.BT_CLK
BT_DATA: U6.25(BT_DATA) ; port CONN_RF.BT_DATA
BT_IN: U6.15(BT_IN) ; port CONN_RF.BT_IN
BT_IP: U6.16(BT_IP) ; port CONN_RF.BT_IP
BT_QN: U6.13(BT_QN) ; port CONN_RF.BT_QN
BT_QP: U6.14(BT_QP) ; port CONN_RF.BT_QP
EN_GPS: U26.5(EN) ; port CONN_RF.EN_GPS
GPS: R77.2 R79.2 U6.39(GPS_RFIN)
GPS_I: U6.12(GPS_IP) ; port CONN_RF.GPS_I
GPS_Q: U6.10(GPS_QP) ; port CONN_RF.GPS_Q
HRST_B: U6.2(CONN_HRST_B) ; port CONN_RF.HRST_B
TOP_CLK: U6.4(CONN_TOP_CLK) ; port CONN_RF.TOP_CLK
TOP_DATA: U6.3(CONN_TOP_DATA) ; port CONN_RF.TOP_DATA
WB_PTA: U6.5(WB_PTA) ; port CONN_RF.WB_PTA
WF_CTRL0: U6.23(WF_CTRL0) ; port CONN_RF.WF_CTRL0
WF_CTRL1: U6.22(WF_CTRL1) ; port CONN_RF.WF_CTRL1
WF_CTRL2: U6.21(WF_CTRL2) ; port CONN_RF.WF_CTRL2
WF_IN: U6.19(WF_IN) ; port CONN_RF.WF_IN
WF_IP: U6.20(WF_IP) ; port CONN_RF.WF_IP
WF_QN: U6.17(WF_QN) ; port CONN_RF.WF_QN
WF_QP: U6.18(WF_QP) ; port CONN_RF.WF_QP
XO_IN: U6.8(XO_IN) ; port CONN_RF.XO_IN
NetC90_2: C90.2 C91.2 U6.6(CEXT)
NetC150_1: C150.1 R82.2 U25.1(IN)
NetC150_2: C150.2 IC2.4(LB)
NetC151_2: C151.2 C295.2 L12.2 U26.4(VDD)
NetC152_1: C152.1 IC2.8(MB)
NetC152_2: C152.2 U27.1(IN)
NetIC2_2: IC2.2(COM) R80.2
NetIC2_6: IC2.6(HB) L11.1
NetJ17_1: J17.1 R80.1
NetJ17_S1: J17.S1 J17.S2 J17.S3 R81.2
NetJ18_1: J18.1 R82.1
NetJ18_S1: J18.S1 J18.S2 J18.S3 R83.2
NetL13_1: L13.1 U25.4(OUT)
NetL13_2: L13.2 U26.3(RFIN)
NetR75_2: R75.2 U6.37(FM_LANT_N)
NetR76_2: R76.2 U6.38(FM_LANT_P)
NetR77_1: R77.1 R78.2 U26.6(RFOUT)

Not connected (* = marked no-connect by the designer): U6 7(NC)* 9(GPS_QN)* 11(GPS_IN)* 32(NC)*

### Library data of the parts
FB4 = BLM18KG121TN1D: Ferrite Bead. 0603. 3A.  DC Resistance(DCR) 30mΩ. 120Ω@100MHz; Manufacturer_Name: Murata Electronics; Datasheet Link: http://www.murata.com/~/media/webrenewal/support/library/catalog/products/emc/emifil/c31e.ashx?la=en-gb; Height: 0.75mm; Manufacturer_Part_Number: BLM18KG121TN1D; Mouser Part Number: 81-BLM18KG121TN1D; Mouser Price/Stock: https://www.mouser.co.uk/ProductDetail/Murata-Electronics/BLM18KG121TN1D?qs=rvfpa0%252BU10PYAwVv0fw24Q%3D%3D; Arrow Part Number: BLM18KG121TN1D; Arrow Price/Stock: https://www.arrow.com/en/products/blm18kg121tn1d/murata-manufacturing?utm_currency=USD&region=nac
FL7 = BLM18BD252SN1D: Inductor Chip Bead 2.5KOhm 25% 100MHz Ferrite 50mA 0603
IC2 = TPX205950MT-7110A1: wifi, bluetooth, GPS. 2.4GHz, 5GHz, 1.6GHz; Manufacturer_Name: TDK; Datasheet Link: https://product.tdk.com/system/files/dam/doc/product/rf/rf/triplexer/catalog/rf_tpx_tpx205950mt-7110a1_en.pdf; Height: 1mm; Manufacturer_Part_Number: TPX205950MT-7110A1; Mouser Part Number: 810-TPX20595MT7110A1; Mouser Price/Stock: https://www.mouser.co.uk/ProductDetail/TDK/TPX205950MT-7110A1?qs=Vpv2%252BhtnxQJqTIwP0boi4g%3D%3D
J17 J18 = CONMHF4-SMD-G-T: MHF4 Jack 50 Ohm PCB Surface Mount
U25 = SAFFB1G56AC0F0AR1X: lọc thông giải GPS
U26 = WS7916DC-6/TR: khuếch đại tín hiệu GPS
U27 = KH-SAWF244A: bộ lọc thông dải 2.4GHz

## Sheet JTAG_Connector.SchDoc
size A4; Author: Nguyễn Hữu Thắng; DrawnBy: Nguyễn Hữu Thắng; SheetNumber: 27; SheetTotal: 36
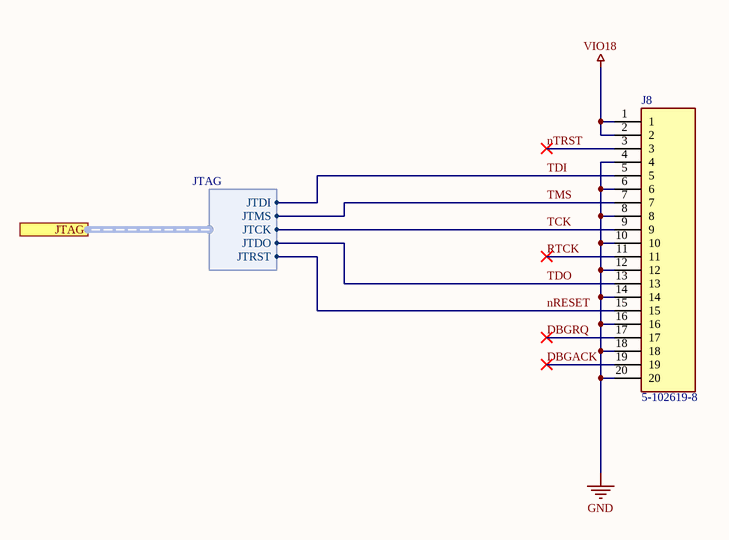
[diagram p18: JTAG_Connector.SchDoc]

### Parts
J8  5-102619-8  [TE_5-102619-8]

### Ports
JTAG (harness JTAG, see main[9000,6700], MT8365[11000,4200], MT8365_Other[1500,1700])

### Harnesses
JTAG: JTCK, JTDI, JTDO, JTMS, JTRST

### Nets
GND: J8.4 J8.6 J8.8 J8.10 J8.12 J8.14 J8.16 J8.18 J8.20
VIO18: J8.1 J8.2
DBGACK: J8.19
DBGRQ: J8.17
nRESET: J8.15 ; port JTAG.JTRST  [project net JTRST]
nTRST: J8.3
RTCK: J8.11
TCK: J8.9 ; port JTAG.JTCK  [project net JTCK]
TDI: J8.5 ; port JTAG.JTDI  [project net JTDI]
TDO: J8.13 ; port JTAG.JTDO  [project net JTDO]
TMS: J8.7 ; port JTAG.JTMS  [project net JTMS]

### Library data of the parts
J8 = 5-102619-8: Conn Shrouded Header HDR 20 POS 2.54mm Solder ST Thru-Hole Tray

## Sheet UART.SchDoc
size A3; Author: Nguyễn Hữu Thắng; DrawnBy: Nguyễn Hữu Thắng; SheetNumber: 29; SheetTotal: 35
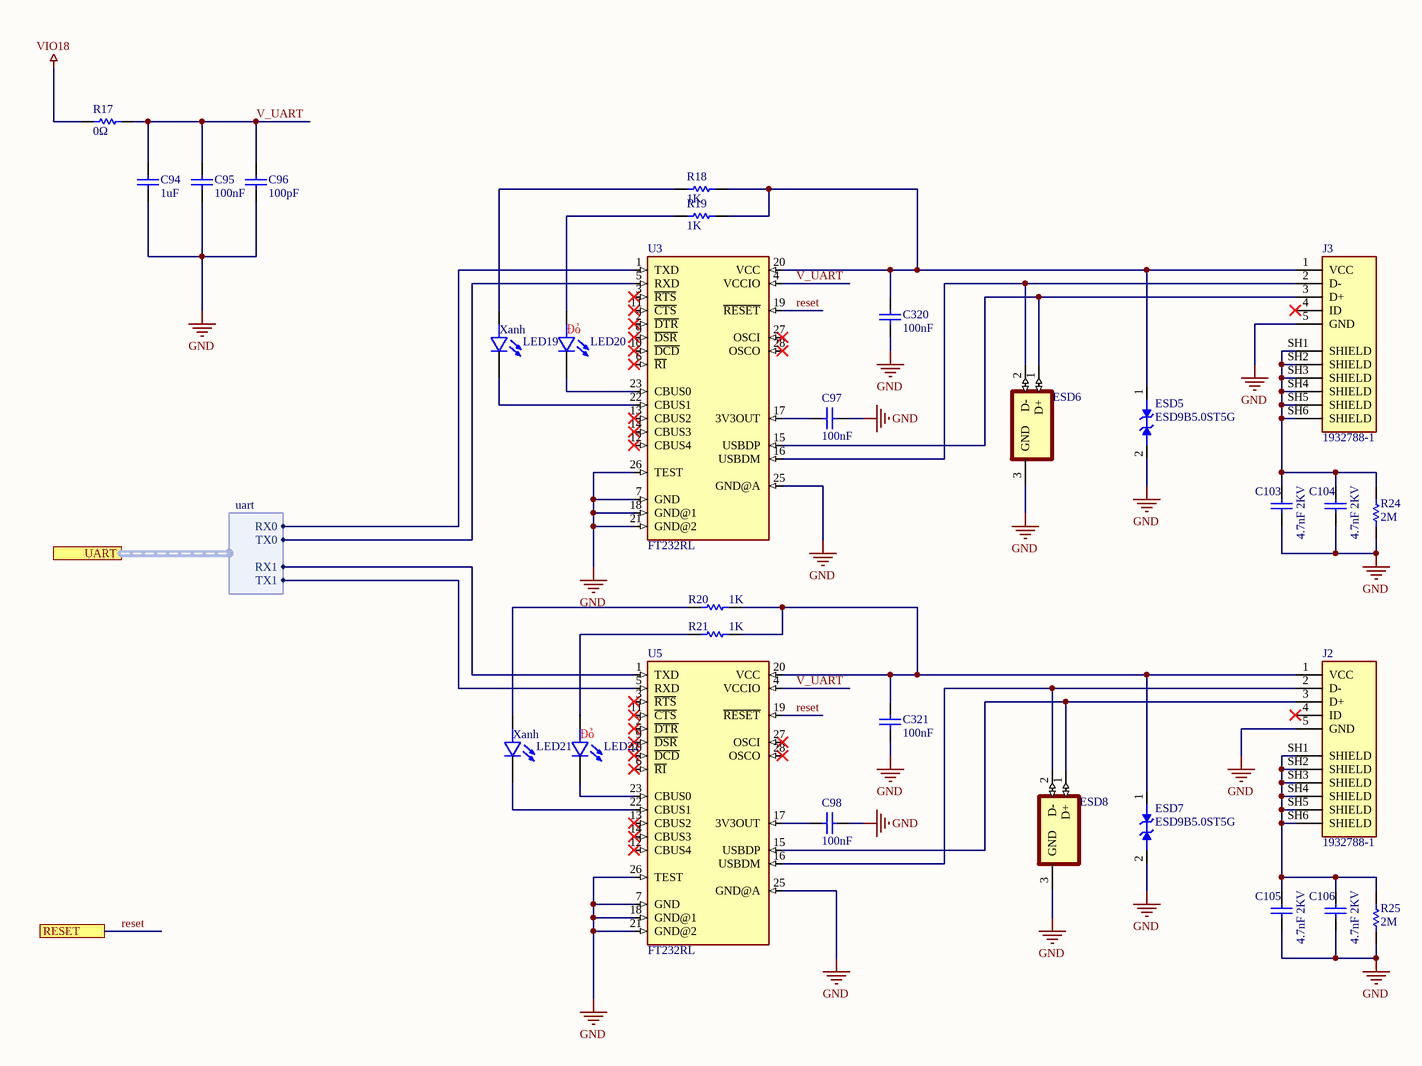
[diagram p19: UART.SchDoc]

### Parts
C94  value 1uF  [C0805]  (hidden comment: C0805)
C95  value 100nF  [C0603]  (hidden comment: C0603)
C96  value 100pF  [C0402]  (hidden comment: C0402)
C97  value 100nF  [C0603]  (hidden comment: C0603)
C98  value 100nF  [C0603]  (hidden comment: C0603)
C103  value 4.7nF 2KV  [C1210]  (hidden comment: C1210)
C104  value 4.7nF 2KV  [C1210]  (hidden comment: C1210)
C105  value 4.7nF 2KV  [C1210]  (hidden comment: C1210)
C106  value 4.7nF 2KV  [C1210]  (hidden comment: C1210)
C320  value 100nF  [C0603]  (hidden comment: C0603)
C321  value 100nF  [C0603]  (hidden comment: C0603)
ESD5  ESD9B5.0ST5G  [SODFL1006X40N]
ESD6  TPD2EUSB30DRTR  [SOTFL35P100X50-3N]  (value not drawn)
ESD7  ESD9B5.0ST5G  [SODFL1006X40N]
ESD8  TPD2EUSB30DRTR  [SOTFL35P100X50-3N]  (value not drawn)
J2  1932788-1  [TE_1932788-1]
J3  1932788-1  [TE_1932788-1]
LED19  LED0402  [LED0402]  (value not drawn)
LED20  LED0402  [LED0402]  (value not drawn)
LED21  LED0402  [LED0402]  (value not drawn)
LED22  LED0402  [LED0402]  (value not drawn)
R17  value 0Ω  [R0603]  (hidden comment: R0603)
R18  value 1K  [R0603]  (hidden comment: R0603)
R19  value 1K  [R0603]  (hidden comment: R0603)
R20  value 1K  [R0603]  (hidden comment: R0603)
R21  value 1K  [R0603]  (hidden comment: R0603)
R24  value 2M  [R0603]  (hidden comment: R0603)
R25  value 2M  [R0603]  (hidden comment: R0603)
U3  FT232RL  [FT232RL]
U5  FT232RL  [FT232RL]

### Ports
RESET (see main[9000,5800], Control_Interface[4100,4800], Power[11300,7100], RTL8201F[12800,5800]), UART (harness uart, see main[9000,5600], MT8365[6300,9000], MT8365_CONN[11800,6800])

### Harnesses
uart: TX0, RX0, TX1, RX1

### Nets
GND: C94.2 C95.1 C96.1 C97.1 C98.1 C103.1 C104.1 C105.1 C106.1 C320.1 C321.1 ESD5.2(A1) ESD6.3(GND) ESD7.2(A1) ESD8.3(GND) J2.5(GND) J3.5(GND) R24.2 R25.2 U3.7(GND) U3.18(GND@1) U3.21(GND@2) U3.25(GND@A) U3.26(TEST) U5.7(GND) U5.18(GND@1) U5.21(GND@2) U5.25(GND@A) U5.26(TEST)
VIO18: R17.1
reset: U3.19(~{RESET}) U5.19(~{RESET}) ; port RESET
V_UART: C94.1 C95.2 C96.2 R17.2 U3.4(VCCIO) U5.4(VCCIO)
NetC97_2: C97.2 U3.17(3V3OUT)
NetC98_2: C98.2 U5.17(3V3OUT)
NetC103_2: C103.2 C104.2 J3.SH1(SHIELD) J3.SH2(SHIELD) J3.SH3(SHIELD) J3.SH4(SHIELD) J3.SH5(SHIELD) J3.SH6(SHIELD) R24.1
NetC105_2: C105.2 C106.2 J2.SH1(SHIELD) J2.SH2(SHIELD) J2.SH3(SHIELD) J2.SH4(SHIELD) J2.SH5(SHIELD) J2.SH6(SHIELD) R25.1
NetC320_2: C320.2 ESD5.1(A) J3.1(VCC) R18.2 R19.2 U3.20(VCC)
NetC321_2: C321.2 ESD7.1(A) J2.1(VCC) R20.2 R21.2 U5.20(VCC)
NetESD6_1: ESD6.1(D+) J3.3(D+) U3.15(USBDP)
NetESD6_2: ESD6.2(D-) J3.2(D-) U3.16(USBDM)
NetESD8_1: ESD8.1(D+) J2.3(D+) U5.15(USBDP)
NetESD8_2: ESD8.2(D-) J2.2(D-) U5.16(USBDM)
NetLED19_A: LED19.A R18.1
NetLED19_C: LED19.C U3.22(CBUS1)
NetLED20_A: LED20.A R19.1
NetLED20_C: LED20.C U3.23(CBUS0)
NetLED21_A: LED21.A R20.1
NetLED21_C: LED21.C U5.22(CBUS1)
NetLED22_A: LED22.A R21.1
NetLED22_C: LED22.C U5.23(CBUS0)
NetU1#2_AF22: U5.1(TXD) ; port UART.RX1
NetU1#2_AF23: U5.5(RXD) ; port UART.TX1
NetU1#2_AH22: U3.1(TXD) ; port UART.RX0
NetU1#2_AH23: U3.5(RXD) ; port UART.TX0

Not connected (* = marked no-connect by the designer): J2 4(ID)*; J3 4(ID)*; U3 2(~{DTR})* 3(~{RTS})* 6(~{RI})* 9(~{DSR})* 10(~{DCD})* 11(~{CTS})* 12(CBUS4)* 13(CBUS2)* 14(CBUS3)* 27(OSCI)* 28(OSCO)*; U5 2(~{DTR})* 3(~{RTS})* 6(~{RI})* 9(~{DSR})* 10(~{DCD})* 11(~{CTS})* 12(CBUS4)* 13(CBUS2)* 14(CBUS3)* 27(OSCI)* 28(OSCO)*

### Notes on the sheet
- (near LED19) Xanh
- (near LED20) Đỏ
- (near LED21) Xanh
- (near LED22) Đỏ

### Library data of the parts
ESD5 ESD7 = ESD9B5.0ST5G: Clamp Ipp Tvs Diode Surface Mount SOD-923
ESD6 ESD8 = TPD2EUSB30DRTR: 2-channel ESD solution for SuperSpeed USB 3.0 interface 3-SOT-9X3 -40 to 85
LED19-LED22 = LED0402: LED SMD

## Sheet RTL8201F.SchDoc
size A3; Author: Nguyễn Hữu Thắng; DrawnBy: Nguyễn Hữu Thắng; SheetNumber: 31; SheetTotal: 35
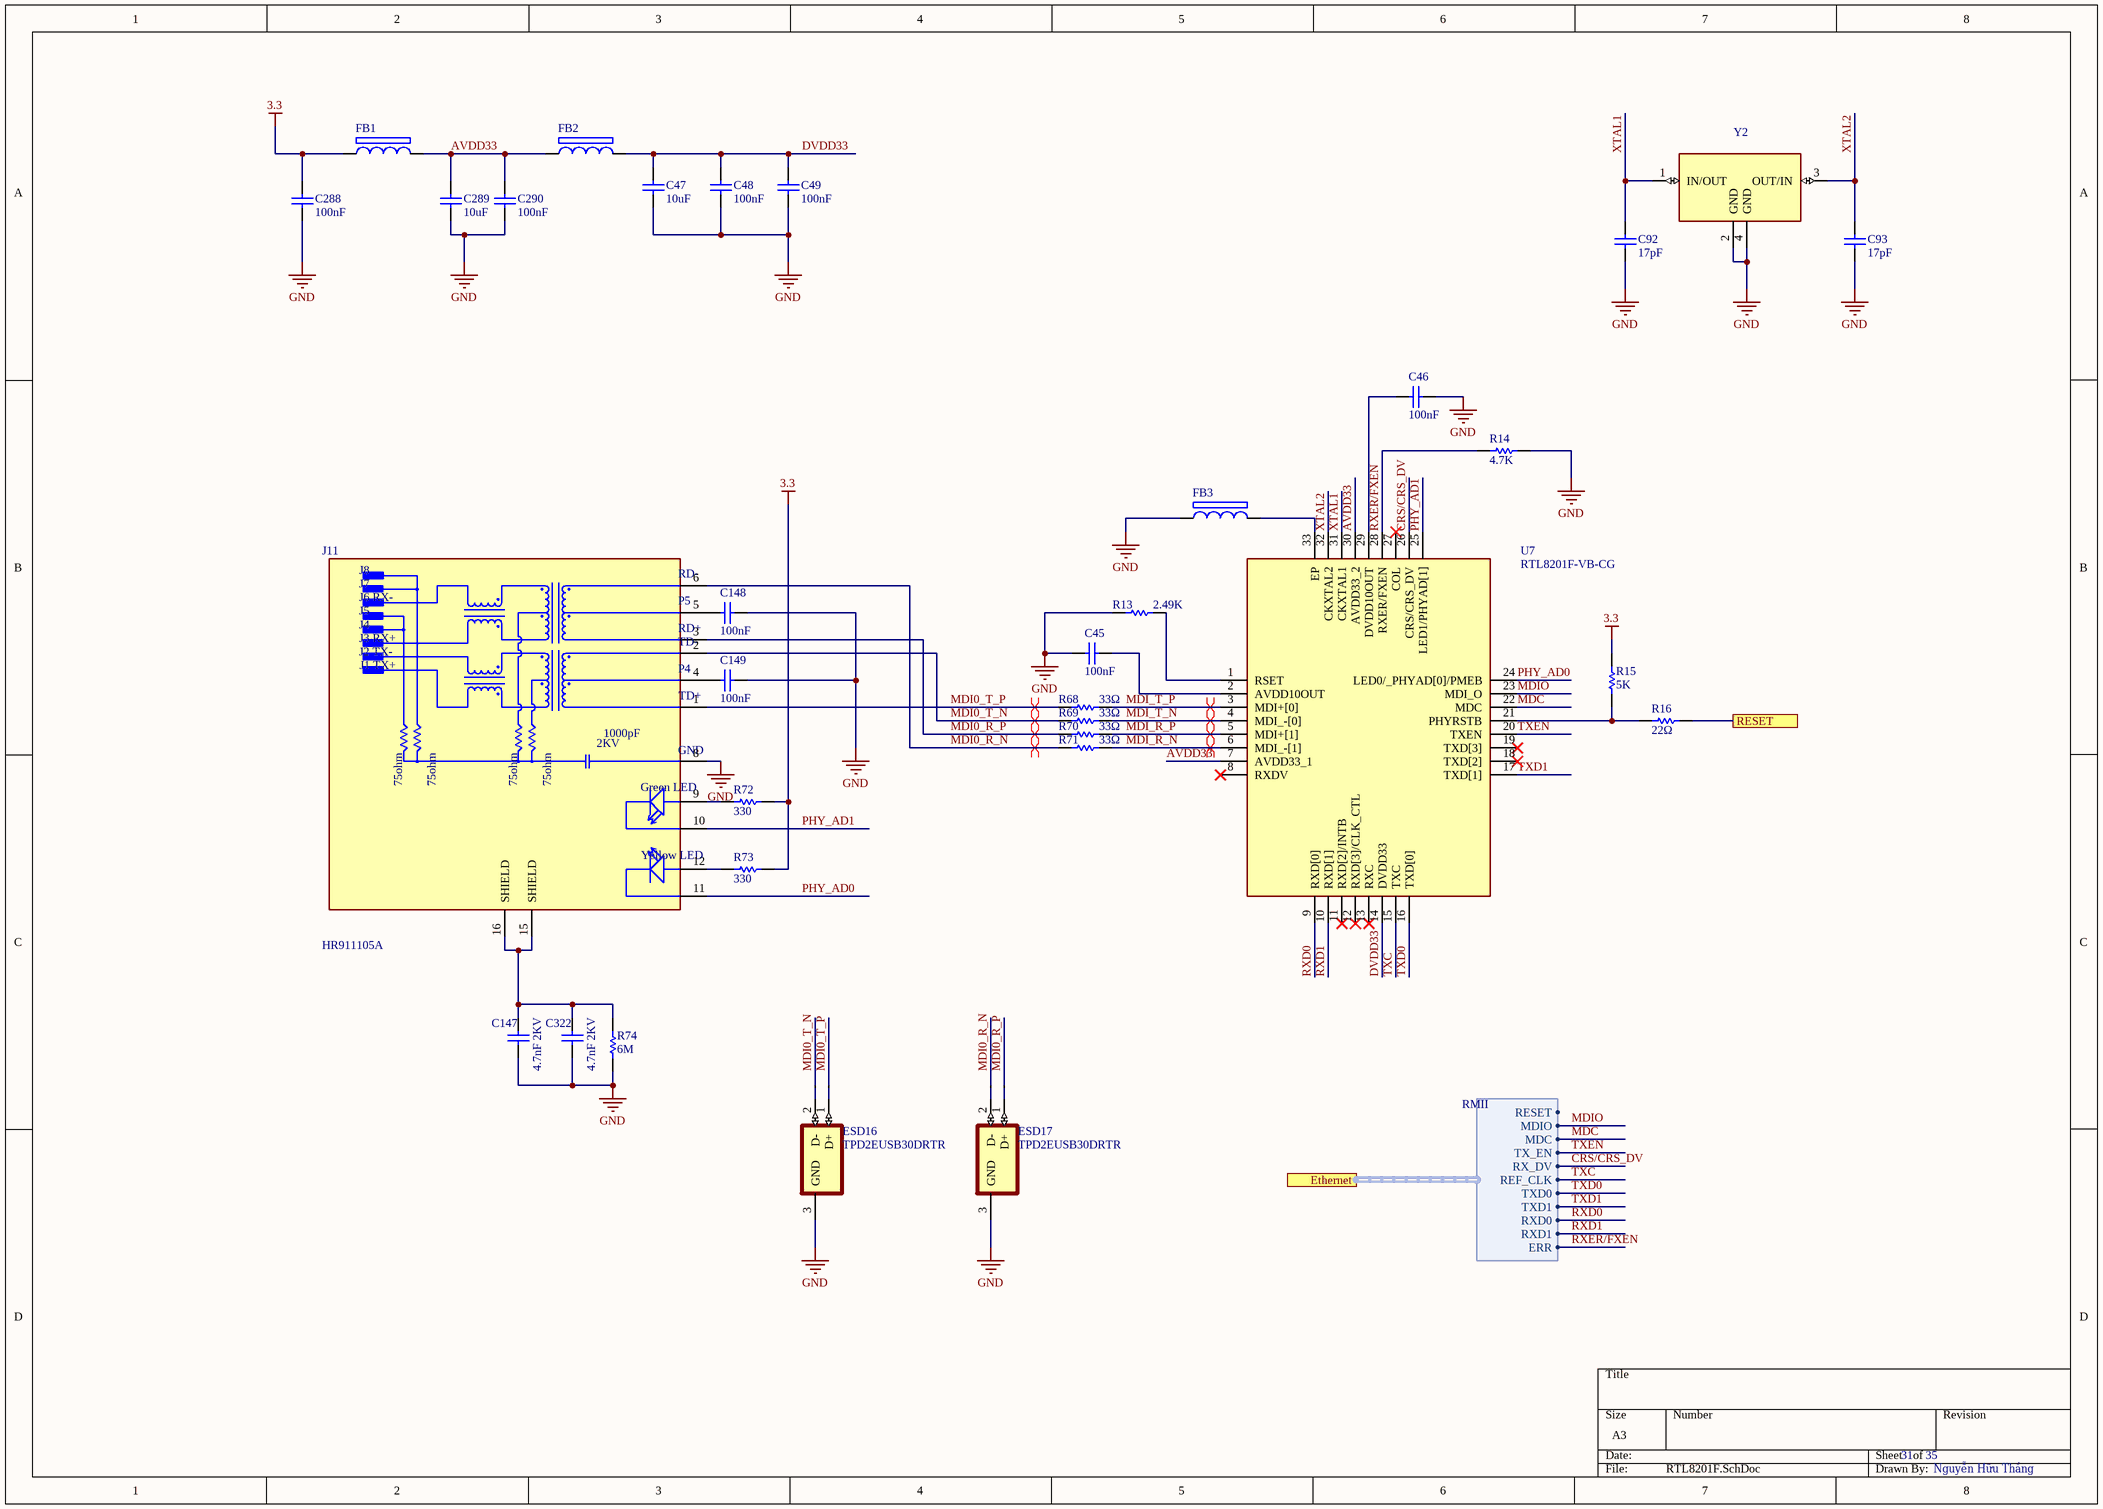
[diagram p20: RTL8201F.SchDoc]

### Parts
.10  P  [P]  (value not drawn)
.12  P  [P]  (value not drawn)
.15  P  [P]  (value not drawn)
.16  P  [P]  (value not drawn)
C45  value 100nF  [C0603]  (hidden comment: C0603)
C46  value 100nF  [C0603]  (hidden comment: C0603)
C47  value 10uF  [C1210]  (hidden comment: C1210)
C48  value 100nF  [C0603]  (hidden comment: C0603)
C49  value 100nF  [C0603]  (hidden comment: C0603)
C92  value 17pF  [C0402]  (hidden comment: C0402)
C93  value 17pF  [C0402]  (hidden comment: C0402)
C147  value 4.7nF 2KV  [C1210]  (hidden comment: C1210)
C148  value 100nF  [C0603]  (hidden comment: C0603)
C149  value 100nF  [C0603]  (hidden comment: C0603)
C288  value 100nF  [C0603]  (hidden comment: C0603)
C289  value 10uF  [C1210]  (hidden comment: C1210)
C290  value 100nF  [C0603]  (hidden comment: C0603)
C322  value 4.7nF 2KV  [C1210]  (hidden comment: C1210)
ESD16  TPD2EUSB30DRTR  [SOTFL35P100X50-3N]
ESD17  TPD2EUSB30DRTR  [SOTFL35P100X50-3N]
FB1  BLM18KG121TN1D  [BLM18EG101TH1D]  (value not drawn)
FB2  BLM18KG121TN1D  [BLM18EG101TH1D]  (value not drawn)
FB3  BLM18KG121TN1D  [BLM18EG101TH1D]  (value not drawn)
J11  HR911105A  [HANRUN_HR911105A]
R13  value 2.49K  [R0603]  (hidden comment: R0603)
R14  value 4.7K  [R0603]  (hidden comment: R0603)
R15  value 5K  [R0603]  (hidden comment: R0603)
R16  value 22Ω  [R0603]  (hidden comment: R0603)
R68  value 33Ω  [R0603]  (hidden comment: R0603)
R69  value 33Ω  [R0603]  (hidden comment: R0603)
R70  value 33Ω  [R0603]  (hidden comment: R0603)
R71  value 33Ω  [R0603]  (hidden comment: R0603)
R72  value 330  [R0603]  (hidden comment: R0603)
R73  value 330  [R0603]  (hidden comment: R0603)
R74  value 6M  [R0603]  (hidden comment: R0603)
U7  RTL8201F-VB-CG  [RTL8201F]
Y2  LGE25.000M  [XTAL_ECS-250-6-33B2-CTN-TR3]  (value not drawn)

### Ports
Ethernet (harness RMII, see main[7600,8000], MT8365[6000,9000], MT8365_CONN[13494.004,8500]), RESET (see main[8200,8000], Control_Interface[4100,4800], Power[11300,7100], UART[1500,3000])

### Harnesses
RMII: MDIO, MDC, TX_EN, RX_DV, REF_CLK, TXD0, TXD1, RXD0, RXD1, RESET, ERR

### Nets
3.3: C288.2 FB1.1 R15.2 R72.2 R73.2
GND: C45.2 C46.1 C47.1 C48.1 C49.1 C92.1 C93.1 C147.1 C148.1 C149.1 C288.1 C289.1 C290.1 C322.1 ESD16.3(GND) ESD17.3(GND) FB3.1 J11.8(GND) R13.1 R14.2 R74.2 Y2.2(GND) Y2.4(GND)
AVDD33: C289.2 C290.2 FB1.2 FB2.1 U7.7(AVDD33_1) U7.30(AVDD33_2)
CRS/CRS_DV: U7.26(CRS/CRS_DV) ; port Ethernet.RX_DV
DVDD33: C47.2 C48.2 C49.2 FB2.2 U7.14(DVDD33)
MDC: U7.22(MDC) ; port Ethernet.MDC  [project net EXT_MDC]
MDI0_R_N: .15.2 J11.6(RD-) R71.1
MDI0_R_P: .16.2 J11.3(RD+) R70.1
MDI0_T_N: .10.2 J11.2(TD-) R69.1
MDI0_T_P: .12.2 J11.1(TD+) R68.1
MDI_R_N: R71.2 U7.6(MDI_-[1])
MDI_R_P: R70.2 U7.5(MDI+[1])
MDI_T_N: R69.2 U7.4(MDI_-[0])
MDI_T_P: R68.2 U7.3(MDI+[0])
MDIO: U7.23(MDI_O) ; port Ethernet.MDIO  [project net EXT_MDIO]
PHY_AD0: J11.11(YC) U7.24(LED0/_PHYAD[0]/PMEB)
PHY_AD1: J11.10(GC) U7.25(LED1/PHYAD[1])
reset: R16.2 ; port RESET
RXD0: U7.9(RXD[0]) ; port Ethernet.RXD0  [project net EXT_RXD0]
RXD1: U7.10(RXD[1]) ; port Ethernet.RXD1  [project net EXT_RXD1]
RXER/FXEN: R14.1 U7.28(RXER/FXEN) ; port Ethernet.ERR  [project net EXT_RXER]
TXC: U7.15(TXC) ; port Ethernet.REF_CLK  [project net EXT_RXC]
TXD0: U7.16(TXD[0]) ; port Ethernet.TXD0  [project net EXT_TXD0]
TXD1: U7.17(TXD[1]) ; port Ethernet.TXD1  [project net EXT_TXD1]
TXEN: U7.20(TXEN) ; port Ethernet.TX_EN  [project net EXT_TXEN]
XTAL1: C92.2 U7.31(CKXTAL1) Y2.1(IN/OUT)
XTAL2: C93.2 U7.32(CKXTAL2) Y2.3(OUT/IN)
Net.10_1: .10.1 ESD16.2(D-)
Net.12_1: .12.1 ESD16.1(D+)
Net.15_1: .15.1 ESD17.2(D-)
Net.16_1: .16.1 ESD17.1(D+)
NetC45_1: C45.1 U7.2(AVDD10OUT)
NetC46_2: C46.2 U7.29(DVDD10OUT)
NetC147_2: C147.2 C322.2 J11.15(SHIELD) J11.16(SHIELD) R74.1
NetC148_2: C148.2 J11.5(P5)
NetC149_2: C149.2 J11.4(P4)
NetFB3_2: FB3.2 U7.33(EP)
NetJ11_9: J11.9(GA) R72.1
NetJ11_12: J11.12(YA) R73.1
NetR13_2: R13.2 U7.1(RSET)
NetR15_1: R15.1 R16.1 U7.21(PHYRSTB)

Not connected (* = marked no-connect by the designer): U7 8(RXDV)* 11(RXD[2]/INTB)* 12(RXD[3]/CLK_CTL)* 13(RXC)* 18(TXD[2])* 19(TXD[3])* 27(COL)*

### Layout directives
differential pair: MDI0_R_N, MDI0_R_P, MDI0_T_N, MDI0_T_P, MDI_R_N, MDI_R_P, MDI_T_N, MDI_T_P

### Notes on the sheet
- (in symbol HR911105A) J8; J7; J6 RX-; J5; J4; J3 RX+; J2 TX-; J1 TX+; 1000pF; 75ohm; 2KV; Green LED; Yellow LED

### Library data of the parts
C92 C93 = C0402: nên chọn tụ từ 14 đến 20 với LGE25.000M
ESD16 ESD17 = TPD2EUSB30DRTR: as ESD6 on sheet UART
FB1-FB3 = BLM18KG121TN1D: as FB4 on sheet MT6631; Datasheet Link: http://www.murata.com/~/media/webrenewal/support/library/catalog/products/emc/emifil/c31e.ashx?la=en-gb; Height: 0.75mm; Manufacturer_Part_Number: BLM18KG121TN1D; Mouser Part Number: 81-BLM18KG121TN1D; Mouser Price/Stock: https://www.mouser.co.uk/ProductDetail/Murata-Electronics/BLM18KG121TN1D?qs=rvfpa0%252BU10PYAwVv0fw24Q%3D%3D; Arrow Part Number: BLM18KG121TN1D; Arrow Price/Stock: https://www.arrow.com/en/products/blm18kg121tn1d/murata-manufacturing?utm_currency=USD&region=nac
J11 = HR911105A: RJ45 có biến áp
U7 = RTL8201F-VB-CG: Integrated Circuit; Manufacturer_Name: Realtek; Datasheet Link: https://pdf1.alldatasheet.com/datasheet-pdf/view/1132250/REALTEK/RTL8201F-VB-CG.html; Height: 1mm; Manufacturer_Part_Number: RTL8201F-VB-CG
Y2 = LGE25.000M: Crystals 25.0000MHZ 12pF SMD 30Ω

## Sheet Power.SchDoc
size A3; Author: Nguyễn Hữu Thắng; DrawnBy: Nguyễn Hữu Thắng; SheetNumber: 18; SheetTotal: 35
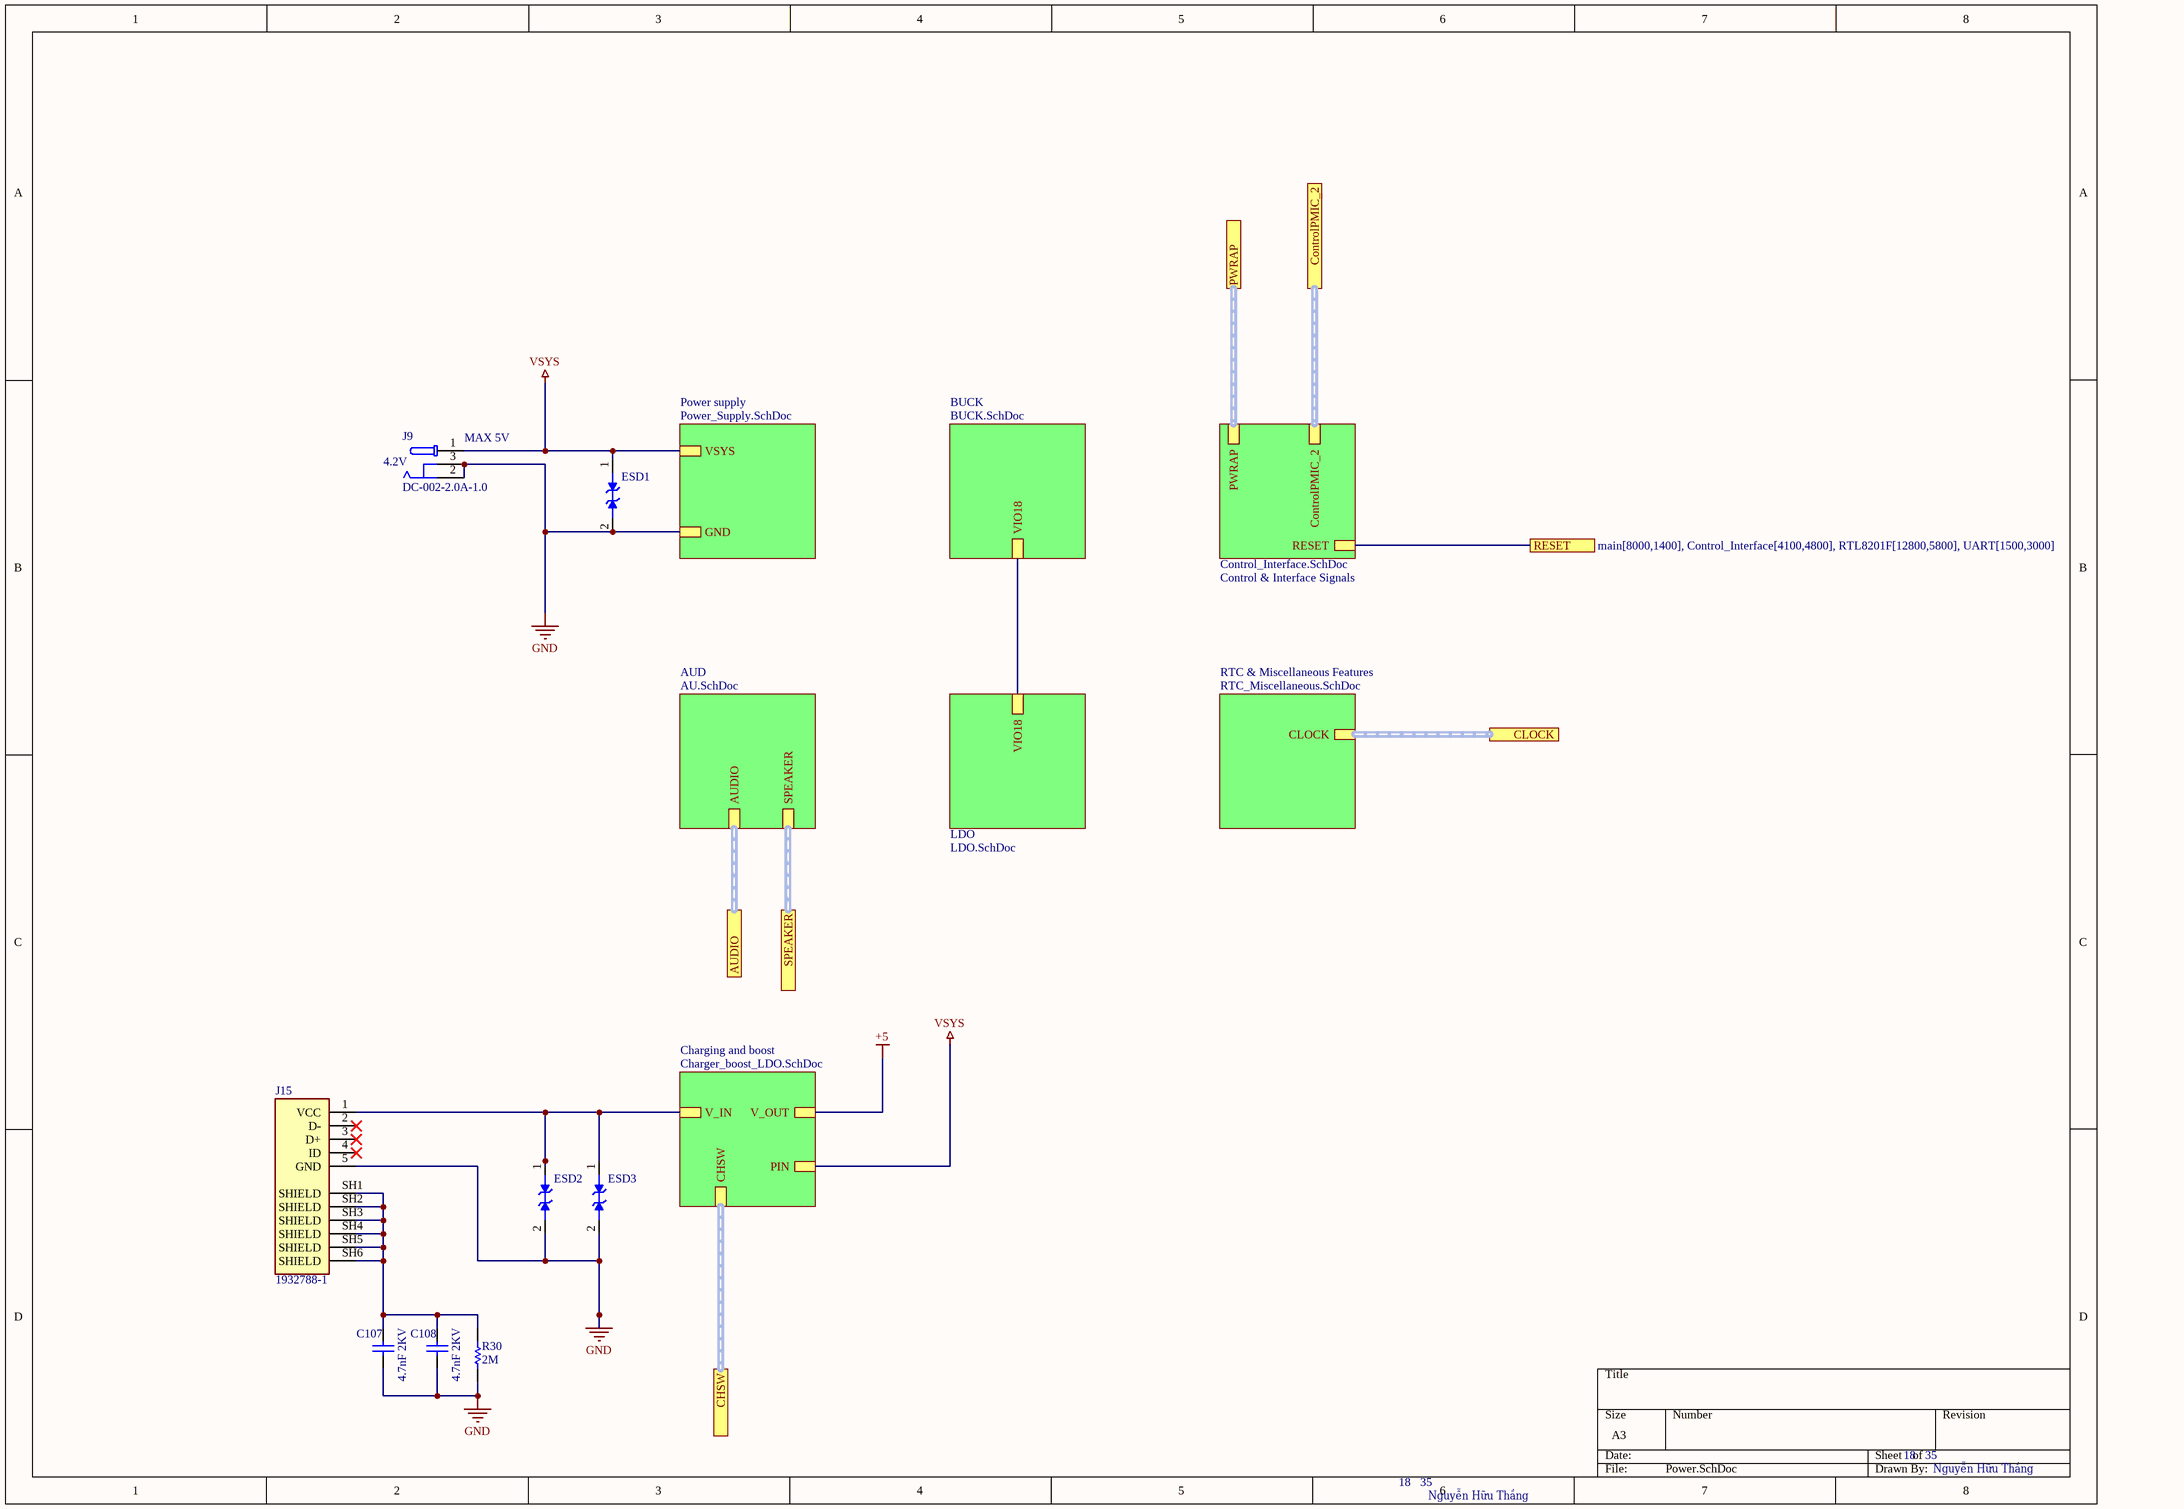
[diagram p21: Power.SchDoc]

### Parts
C107  value 4.7nF 2KV  [C1210]  (hidden comment: C1210)
C108  value 4.7nF 2KV  [C1210]  (hidden comment: C1210)
ESD1  ESD9B5.0ST5G  [SODFL1006X40N]  (value not drawn)
ESD2  ESD9B5.0ST5G  [SODFL1006X40N]  (value not drawn)
ESD3  ESD9B5.0ST5G  [SODFL1006X40N]  (value not drawn)
J9  DC-002-2.0A-1.0  [DC00220A10]
J15  1932788-1  [TE_1932788-1]
R30  value 2M  [R0603]  (hidden comment: R0603)

### Sub-sheets
AUD = AU.SchDoc: AUDIO, SPEAKER
BUCK = BUCK.SchDoc: VIO18
Charging and boost = Charger_boost_LDO.SchDoc: V_IN, V_OUT, PIN, CHSW
Control & Interface Signals = Control_Interface.SchDoc: PWRAP, ControlPMIC_2, RESET
LDO = LDO.SchDoc: VIO18
Power supply = Power_Supply.SchDoc: VSYS, GND
RTC & Miscellaneous Features = RTC_Miscellaneous.SchDoc: CLOCK

### Ports
AUDIO (see main[7600,2000], AU[6600,8200], MT8365[10000,5800], MT8365_AUD[2500,6000]), CHSW (see main[7900,2000], Charger_boost_LDO[1400,3400], I2C_Switch[500,7800]), CLOCK (see main[6700,2000], MT8365[11000,4500], MT8365_Other[1500,5800], RTC_Miscellaneous[2500,1800]), ControlPMIC_2 (see main[7300,2000], Control_Interface[3100,2200], MT8365[11000,4800], MT8365_Other[1000,3700]), PWRAP (see main[7000,2000], Control_Interface[3900,4400], MT8365[5500,9000], MT8365_CONN[4500,8700]), RESET (see main[8000,1400], Control_Interface[4100,4800], RTL8201F[12800,5800], UART[1500,3000]), SPEAKER (see main[5000,1100], AU[14100,7200], AUDIO_AMP[397.796,3600])

### Nets
GND: C107.1 C108.1 ESD1.2(A1) ESD2.2(A1) ESD3.2(A1) J9.2 J9.3 J15.5(GND) R30.2 ; sheet Power supply/GND
VSYS: ESD1.1(A) J9.1 ; sheet Power supply/VSYS, sheet Charging and boost/PIN
reset: port RESET, sheet Control & Interface Signals/RESET
VIO_18: sheet BUCK/VIO18, sheet LDO/VIO18
NetC107_2: C107.2 C108.2 J15.SH1(SHIELD) J15.SH2(SHIELD) J15.SH3(SHIELD) J15.SH4(SHIELD) J15.SH5(SHIELD) J15.SH6(SHIELD) R30.1
NetC109_2: ESD2.1(A) ESD3.1(A) J15.1(VCC) ; sheet Charging and boost/V_IN

Not connected (* = marked no-connect by the designer): J15 2(D-)* 3(D+)* 4(ID)*

### Buses and harness runs
harness port AUDIO = sheet AUD/AUDIO
harness port CHSW = sheet Charging and boost/CHSW
harness port CLOCK = sheet RTC & Miscellaneous Features/CLOCK
harness port ControlPMIC_2 = sheet Control & Interface Signals/ControlPMIC_2
harness port PWRAP = sheet Control & Interface Signals/PWRAP
harness port SPEAKER = sheet AUD/SPEAKER

### Notes on the sheet
- (near J9) MAX 5V
- (near J9) 4.2V

### Library data of the parts
ESD1-ESD3 = ESD9B5.0ST5G: as ESD5 on sheet UART
J9 = DC-002-2.0A-1.0: Connector; Manufacturer_Name: XKB Connectivity; Datasheet Link: http://www.helloxkb.com/public/images/pdf/DC-002-2.0A-1.0.pdf; Height: 7.6mm; Manufacturer_Part_Number: DC-002-2.0A-1.0

## Sheet Power_Supply.SchDoc
size A3; SheetNumber: 19; SheetTotal: 35
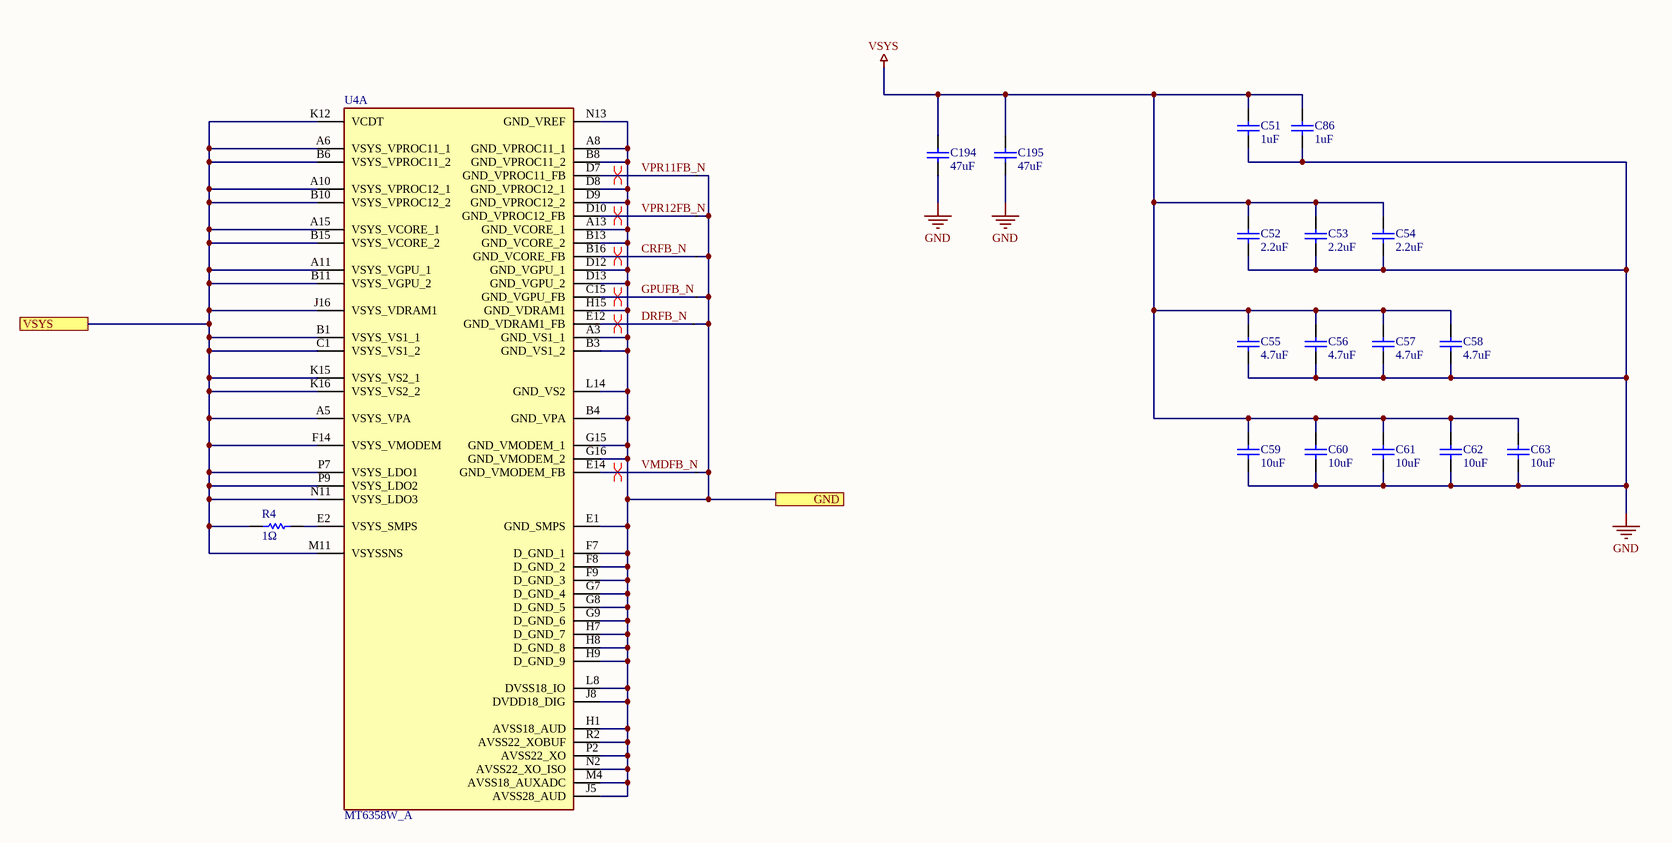
[diagram p22: Power_Supply.SchDoc]

### Parts
.1  P  [P]  (value not drawn)
.2  P  [P]  (value not drawn)
.3  P  [P]  (value not drawn)
.4  P  [P]  (value not drawn)
.5  P  [P]  (value not drawn)
.8  P  [P]  (value not drawn)
C51  value 1uF  [C0805]  (hidden comment: C0805)
C52  value 2.2uF  [C0805]  (hidden comment: C0805)
C53  value 2.2uF  [C0805]  (hidden comment: C0805)
C54  value 2.2uF  [C0805]  (hidden comment: C0805)
C55  value 4.7uF  [C0805]  (hidden comment: C0805)
C56  value 4.7uF  [C0805]  (hidden comment: C0805)
C57  value 4.7uF  [C0805]  (hidden comment: C0805)
C58  value 4.7uF  [C0805]  (hidden comment: C0805)
C59  value 10uF  [C1210]  (hidden comment: C1210)
C60  value 10uF  [C1210]  (hidden comment: C1210)
C61  value 10uF  [C1210]  (hidden comment: C1210)
C62  value 10uF  [C1210]  (hidden comment: C1210)
C63  value 10uF  [C1210]  (hidden comment: C1210)
C86  value 1uF  [C0805]  (hidden comment: C0805)
C194  value 47uF  [C1812]  (hidden comment: C1812)
C195  value 47uF  [C1812]  (hidden comment: C1812)
R4  value 1Ω  [R0603]  (hidden comment: R0603)
U4  MT6358W_A  [BGA194C40P16X15_640X600X66]  (part A of 6)

### Ports
GND (see Power[5000,7200]), VSYS (see Power[5000,7800])

### Nets
GND: .1.2 .2.2 .3.2 .4.2 .5.2 .8.2 C51.1 C52.1 C53.1 C54.1 C55.1 C56.1 C57.1 C58.1 C59.1 C60.1 C61.1 C62.1 C63.1 C86.1 C194.1 C195.1 U4.A3(GND_VS1_1) U4.A8(GND_VPROC11_1) U4.A13(GND_VCORE_1) U4.B3(GND_VS1_2) U4.B4(GND_VPA) U4.B8(GND_VPROC11_2) U4.B13(GND_VCORE_2) U4.D8(GND_VPROC12_1) U4.D9(GND_VPROC12_2) U4.D12(GND_VGPU_1) U4.D13(GND_VGPU_2) U4.E1(GND_SMPS) U4.F7(D_GND_1) U4.F8(D_GND_2) U4.F9(D_GND_3) U4.G7(D_GND_4) U4.G8(D_GND_5) U4.G9(D_GND_6) U4.G15(GND_VMODEM_1) U4.G16(GND_VMODEM_2) U4.H1(AVSS18_AUD) U4.H7(D_GND_7) U4.H8(D_GND_8) U4.H9(D_GND_9) U4.H15(GND_VDRAM1) U4.J5(AVSS28_AUD) U4.J8(DVDD18_DIG) U4.L8(DVSS18_IO) U4.L14(GND_VS2) U4.M4(AVSS18_AUXADC) U4.N2(AVSS22_XO_ISO) U4.N13(GND_VREF) U4.P2(AVSS22_XO) U4.R2(AVSS22_XOBUF) ; port GND
VSYS: C51.2 C52.2 C53.2 C54.2 C55.2 C56.2 C57.2 C58.2 C59.2 C60.2 C61.2 C62.2 C63.2 C86.2 C194.2 C195.2 R4.1 U4.A5(VSYS_VPA) U4.A6(VSYS_VPROC11_1) U4.A10(VSYS_VPROC12_1) U4.A11(VSYS_VGPU_1) U4.A15(VSYS_VCORE_1) U4.B1(VSYS_VS1_1) U4.B6(VSYS_VPROC11_2) U4.B10(VSYS_VPROC12_2) U4.B11(VSYS_VGPU_2) U4.B15(VSYS_VCORE_2) U4.C1(VSYS_VS1_2) U4.F14(VSYS_VMODEM) U4.J16(VSYS_VDRAM1) U4.K12(VCDT) U4.K15(VSYS_VS2_1) U4.K16(VSYS_VS2_2) U4.M11(VSYSSNS) U4.N11(VSYS_LDO3) U4.P7(VSYS_LDO1) U4.P9(VSYS_LDO2) ; port VSYS
CRFB_N: .3.1 U4.B16(GND_VCORE_FB)
DRFB_N: .8.1 U4.E12(GND_VDRAM1_FB)
GPUFB_N: .4.1 U4.C15(GND_VGPU_FB)
VMDFB_N: .5.1 U4.E14(GND_VMODEM_FB)
VPR11FB_N: .1.1 U4.D7(GND_VPROC11_FB)
VPR12FB_N: .2.1 U4.D10(GND_VPROC12_FB)
NetR4_2: R4.2 U4.E2(VSYS_SMPS)

### Layout directives
differential pair: CRFB_N, DRFB_N, GPUFB_N, VMDFB_N, VPR11FB_N, VPR12FB_N

### Library data of the parts
U4 = MT6358W_A: PMIC; Manufacturer_Name: Mediatek; Manufacturer_Part_Number: MT6358W/A; Datasheet Link: https://www.mouser.com/catalog/specsheets/MediaTek_MTK_MT6358_Product_Brief_v1_0.pdf?_gl=1*14yevt7*_ga*OTAyMjU2NDU3LjE2ODExMDUyMzk.*_ga_1KQLCYKRX3*MTcwODA1NjU3MS4xMTcuMC4xNzA4MDU2NTczLjAuMC4w*_ga_15W4STQT4T*MTcwODA1NjU3Mi4xNzIuMC4xNzA4MDU2NTczLjU5LjAuMA..; Height: 0.66mm; Mouser Part Number: 840-MT6358W/A; Mouser Price/Stock: https://www.mouser.co.uk/ProductDetail/MediaTek/MT6358W-A?qs=Jm2GQyTW%2FbiK3FZkyfX0lQ%3D%3D

## Sheet BUCK.SchDoc
size A3; SheetNumber: 20; SheetTotal: 35
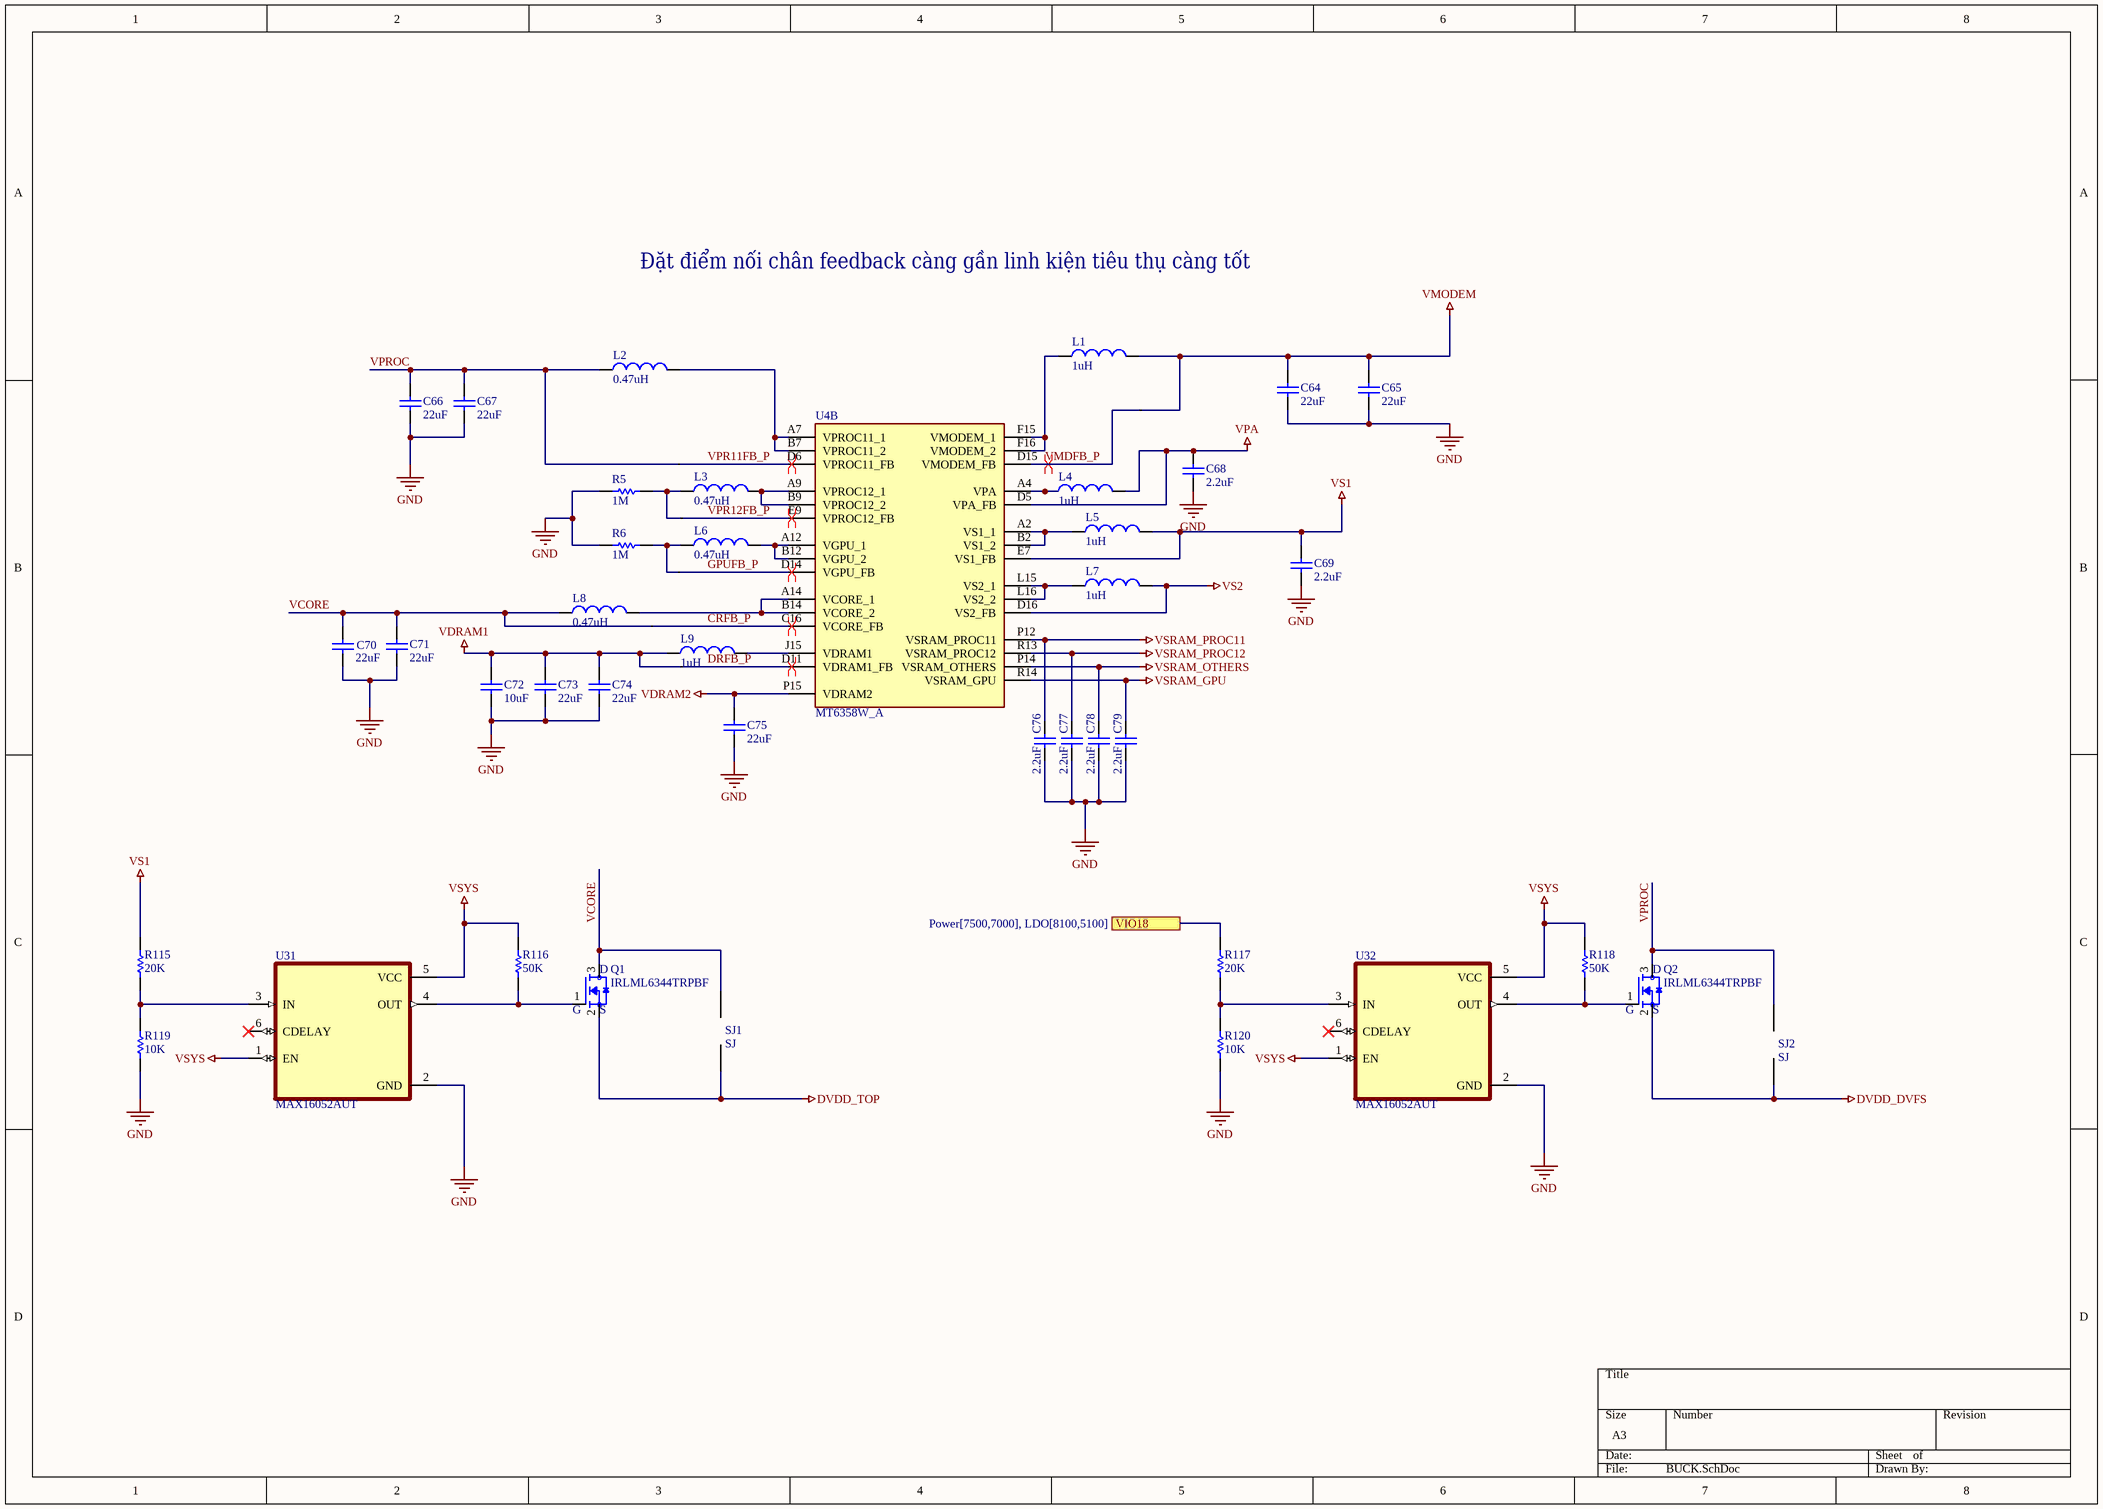
[diagram p23: BUCK.SchDoc]

### Parts
.6  P  [P]  (value not drawn)
.7  P  [P]  (value not drawn)
.9  P  [P]  (value not drawn)
.11  P  [P]  (value not drawn)
.13  P  [P]  (value not drawn)
.14  P  [P]  (value not drawn)
C64  value 22uF  [C1210]  (hidden comment: C1210)
C65  value 22uF  [C1210]  (hidden comment: C1210)
C66  value 22uF  [C1210]  (hidden comment: C1210)
C67  value 22uF  [C1210]  (hidden comment: C1210)
C68  value 2.2uF  [C0805]  (hidden comment: C0805)
C69  value 2.2uF  [C0805]  (hidden comment: C0805)
C70  value 22uF  [C1210]  (hidden comment: C1210)
C71  value 22uF  [C1210]  (hidden comment: C1210)
C72  value 10uF  [C1210]  (hidden comment: C1210)
C73  value 22uF  [C1210]  (hidden comment: C1210)
C74  value 22uF  [C1210]  (hidden comment: C1210)
C75  value 22uF  [C1210]  (hidden comment: C1210)
C76  value 2.2uF  [C0805]  (hidden comment: C0805)
C77  value 2.2uF  [C0805]  (hidden comment: C0805)
C78  value 2.2uF  [C0805]  (hidden comment: C0805)
C79  value 2.2uF  [C0805]  (hidden comment: C0805)
L1  value 1uH  [L0806]  (hidden comment: L0806)
L2  value 0.47uH  [L0806]  (hidden comment: L0806)
L3  value 0.47uH  [L0806]  (hidden comment: L0806)
L4  value 1uH  [L0806]  (hidden comment: L0806)
L5  value 1uH  [L0806]  (hidden comment: L0806)
L6  value 0.47uH  [L0806]  (hidden comment: L0806)
L7  value 1uH  [L0806]  (hidden comment: L0806)
L8  value 0.47uH  [L0806]  (hidden comment: L0806)
L9  value 1uH  [L0806]  (hidden comment: L0806)
Q1  IRLML6344TRPBF  [SOT95P240X112-3N]
Q2  IRLML6344TRPBF  [SOT95P240X112-3N]
R5  value 1M  [R0603]  (hidden comment: R0603)
R6  value 1M  [R0603]  (hidden comment: R0603)
R115  value 20K  [R0603]  (hidden comment: R0603)
R116  value 50K  [R0603]  (hidden comment: R0603)
R117  value 20K  [R0603]  (hidden comment: R0603)
R118  value 50K  [R0603]  (hidden comment: R0603)
R119  value 10K  [R0603]  (hidden comment: R0603)
R120  value 10K  [R0603]  (hidden comment: R0603)
SJ1  SJ  [SJ2]
SJ2  SJ  [SJ2]
U4  MT6358W_A  [BGA194C40P16X15_640X600X66]  (part B of 6)
U31  MAX16052AUT  [SOT95P280X145-6N]
U32  MAX16052AUT  [SOT95P280X145-6N]

### Ports
VIO18 (see Power[7500,7000], LDO[8100,5100])

### Nets
DVDD_DVFS: Q2.2(S) SJ2.1
DVDD_TOP: Q1.2(S) SJ1.1
GND: C64.1 C65.1 C66.1 C67.1 C68.1 C69.1 C70.1 C71.1 C72.1 C73.1 C74.1 C75.1 C76.1 C77.1 C78.1 C79.1 R5.1 R6.1 R119.1 R120.1 U31.2(GND) U32.2(GND)
VDRAM1: .14.1 C72.2 C73.2 C74.2 L9.1  [project net ODT_CA_a]
VDRAM2: C75.2 U4.P15(VDRAM2)
VMODEM: .6.2 C64.2 C65.2 L1.2
VPA: C68.2 L4.2 U4.D5(VPA_FB)
VS1: C69.2 L5.2 R115.2 U4.E7(VS1_FB)
VS2: L7.2 U4.D16(VS2_FB)
VSRAM_GPU: C79.2 U4.R14(VSRAM_GPU)
VSRAM_OTHERS: C78.2 U4.P14(VSRAM_OTHERS)
VSRAM_PROC11: C76.2 U4.P12(VSRAM_PROC11)
VSRAM_PROC12: C77.2 U4.R13(VSRAM_PROC12)
VSYS: R116.2 R118.2 U31.1(EN) U31.5(VCC) U32.1(EN) U32.5(VCC)
CRFB_P: .13.2 U4.C16(VCORE_FB)
DRFB_P: .14.2 U4.D11(VDRAM1_FB)
GPUFB_P: .11.2 U4.D14(VGPU_FB)
VCORE: .13.1 C70.2 C71.2 L8.1 Q1.3(D) SJ1.2
VIO_18: R117.2 ; port VIO18
VMDFB_P: .6.1 U4.D15(VMODEM_FB)
VPR11FB_P: .7.2 U4.D6(VPROC11_FB)
VPR12FB_P: .9.2 U4.E9(VPROC12_FB)
VPROC: .7.1 C66.2 C67.2 L2.1 Q2.3(D) SJ2.2
Net.9_1: .9.1 L3.1 R5.2
Net.11_1: .11.1 L6.1 R6.2
NetL1_1: L1.1 U4.F15(VMODEM_1) U4.F16(VMODEM_2)
NetL2_2: L2.2 U4.A7(VPROC11_1) U4.B7(VPROC11_2)
NetL3_2: L3.2 U4.A9(VPROC12_1) U4.B9(VPROC12_2)
NetL4_1: L4.1 U4.A4(VPA)
NetL5_1: L5.1 U4.A2(VS1_1) U4.B2(VS1_2)
NetL6_2: L6.2 U4.A12(VGPU_1) U4.B12(VGPU_2)
NetL7_1: L7.1 U4.L15(VS2_1) U4.L16(VS2_2)
NetL8_2: L8.2 U4.A14(VCORE_1) U4.B14(VCORE_2)
NetL9_2: L9.2 U4.J15(VDRAM1)
NetQ1_1: Q1.1(G) R116.1 U31.4(OUT)
NetQ2_1: Q2.1(G) R118.1 U32.4(OUT)
NetR115_1: R115.1 R119.2 U31.3(IN)
NetR117_1: R117.1 R120.2 U32.3(IN)

Not connected (* = marked no-connect by the designer): U31 6(CDELAY)*; U32 6(CDELAY)*

### Layout directives
differential pair: CRFB_P, DRFB_P, GPUFB_P, VMDFB_P, VPR11FB_P, VPR12FB_P

### Notes on the sheet
- Đặt điểm nối chân feedback càng gần linh kiện tiêu thụ càng tốt

### Library data of the parts
L1-L9 = L0806: Inductor / SMD:1.6x2mm
Q1 Q2 = IRLML6344TRPBF: IRLML6344TRPBF N-channel MOSFET Transistor, 5 A, 30 V, 3-Pin SOT-23 | Infineon IRLML6344TRPBF
SJ1 SJ2 = SJ: Để hở. hàn 2 đầu lại nếu cần
U4 = MT6358W_A: Integrated Circuit; Manufacturer_Name: Mediatek; Manufacturer_Part_Number: MT6358W/A; Datasheet Link: https://www.mouser.com/catalog/specsheets/MediaTek_MTK_MT6358_Product_Brief_v1_0.pdf?_gl=1*14yevt7*_ga*OTAyMjU2NDU3LjE2ODExMDUyMzk.*_ga_1KQLCYKRX3*MTcwODA1NjU3MS4xMTcuMC4xNzA4MDU2NTczLjAuMC4w*_ga_15W4STQT4T*MTcwODA1NjU3Mi4xNzIuMC4xNzA4MDU2NTczLjU5LjAuMA..; Height: 0.66mm; Mouser Part Number: 840-MT6358W/A; Mouser Price/Stock: https://www.mouser.co.uk/ProductDetail/MediaTek/MT6358W-A?qs=Jm2GQyTW%2FbiK3FZkyfX0lQ%3D%3D
U31 U32 = MAX16052AUT: High-Voltage, Adjustable Sequencing/Supervisory Circuitss

## Sheet LDO.SchDoc
size A4; SheetNumber: 21; SheetTotal: 36
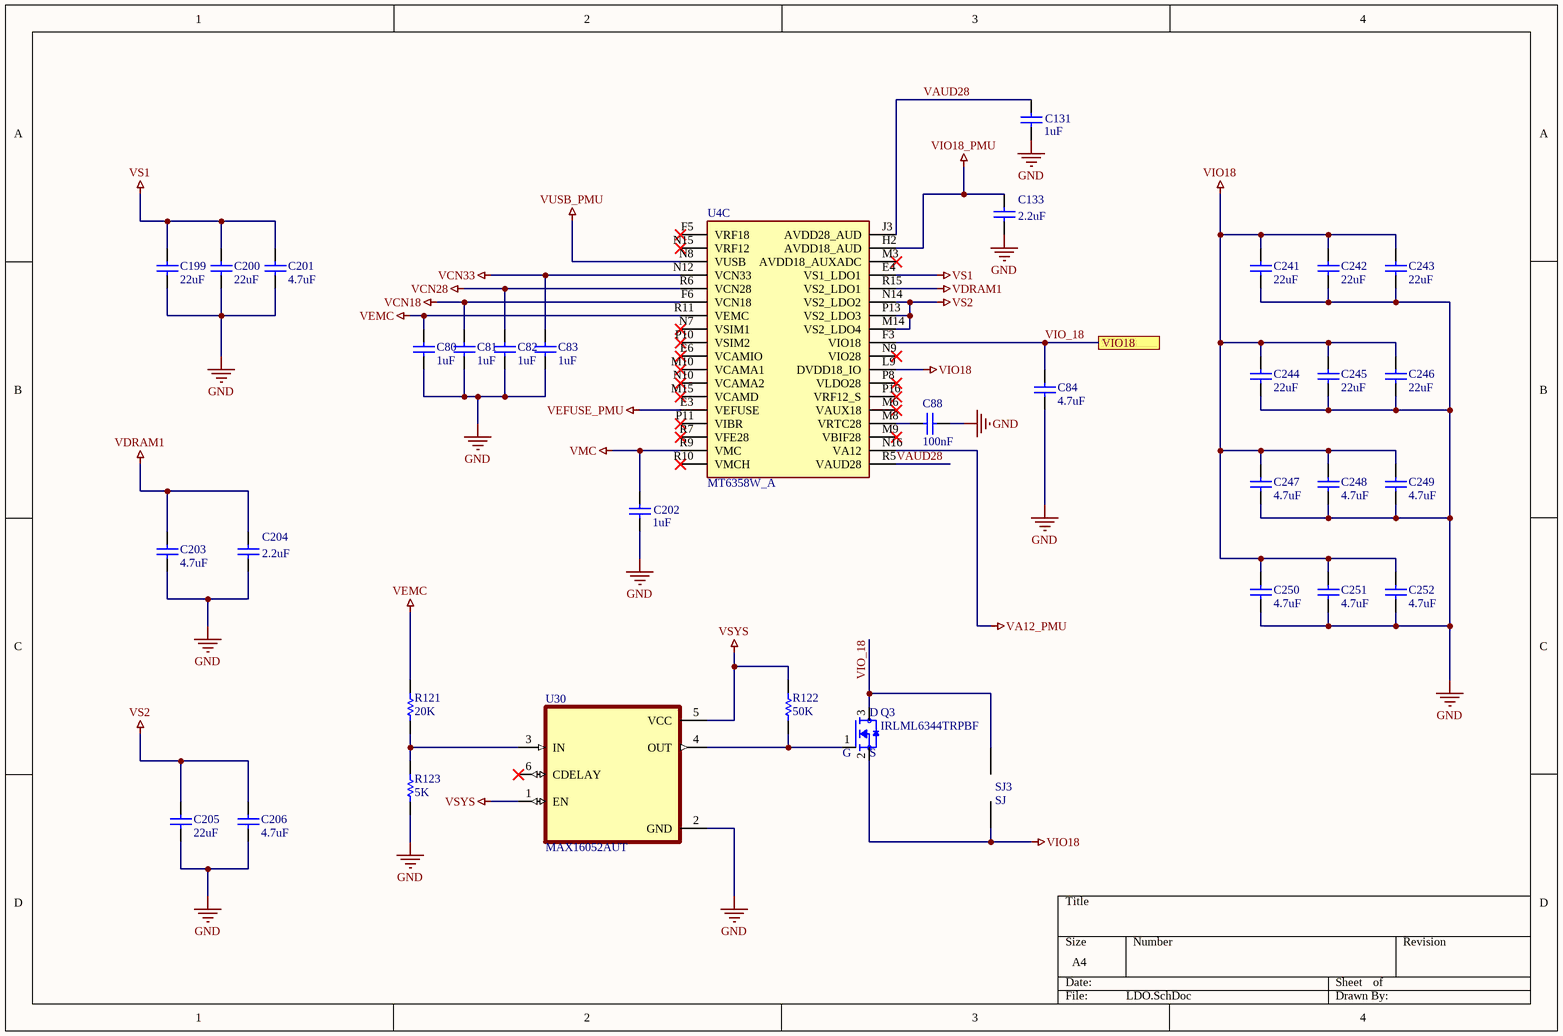
[diagram p24: LDO.SchDoc]

### Parts
C80  value 1uF  [C0805]  (hidden comment: C0805)
C81  value 1uF  [C0805]  (hidden comment: C0805)
C82  value 1uF  [C0805]  (hidden comment: C0805)
C83  value 1uF  [C0805]  (hidden comment: C0805)
C84  value 4.7uF  [C0805]  (hidden comment: C0805)
C88  value 100nF  [C0603]  (hidden comment: C0603)
C131  value 1uF  [C0805]  (hidden comment: C0805)
C133  value 2.2uF  [C0805]  (hidden comment: C0805)
C199  value 22uF  [C1210]  (hidden comment: C1210)
C200  value 22uF  [C1210]  (hidden comment: C1210)
C201  value 4.7uF  [C0805]  (hidden comment: C0805)
C202  value 1uF  [C0805]  (hidden comment: C0805)
C203  value 4.7uF  [C0805]  (hidden comment: C0805)
C204  value 2.2uF  [C0805]  (hidden comment: C0805)
C205  value 22uF  [C1210]  (hidden comment: C1210)
C206  value 4.7uF  [C0805]  (hidden comment: C0805)
C241  value 22uF  [C1210]  (hidden comment: C1210)
C242  value 22uF  [C1210]  (hidden comment: C1210)
C243  value 22uF  [C1210]  (hidden comment: C1210)
C244  value 22uF  [C1210]  (hidden comment: C1210)
C245  value 22uF  [C1210]  (hidden comment: C1210)
C246  value 22uF  [C1210]  (hidden comment: C1210)
C247  value 4.7uF  [C0805]  (hidden comment: C0805)
C248  value 4.7uF  [C0805]  (hidden comment: C0805)
C249  value 4.7uF  [C0805]  (hidden comment: C0805)
C250  value 4.7uF  [C0805]  (hidden comment: C0805)
C251  value 4.7uF  [C0805]  (hidden comment: C0805)
C252  value 4.7uF  [C0805]  (hidden comment: C0805)
Q3  IRLML6344TRPBF  [SOT95P240X112-3N]
R121  value 20K  [R0603]  (hidden comment: R0603)
R122  value 50K  [R0603]  (hidden comment: R0603)
R123  value 5K  [R0603]  (hidden comment: R0603)
SJ3  SJ  [SJ2]
U4  MT6358W_A  [BGA194C40P16X15_640X600X66]  (part C of 6)
U30  MAX16052AUT  [SOT95P280X145-6N]

### Ports
VIO18 (see Power[7500,6000], BUCK[8200,4300])

### Nets
GND: C80.1 C81.1 C82.1 C83.1 C84.1 C88.1 C131.1 C133.1 C199.1 C200.1 C201.1 C202.1 C203.1 C204.1 C205.1 C206.1 C241.1 C242.1 C243.1 C244.1 C245.1 C246.1 C247.1 C248.1 C249.1 C250.1 C251.1 C252.1 R123.1 U30.2(GND)
VA12_PMU: U4.N16(VA12)
VCN18: C81.2 U4.F6(VCN18)  [project net AAVDD18_GPS]
VCN28: C82.2 U4.R6(VCN28)
VCN33: C83.2 U4.N12(VCN33)  [project net AVDD33_WBT]
VDRAM1: C203.2 C204.2 U4.R15(VS2_LDO1)  [project net ODT_CA_a]
VEFUSE_PMU: U4.E3(VEFUSE)
VEMC: C80.2 R121.2 U4.R11(VEMC)
VIO18: C241.2 C242.2 C243.2 C244.2 C245.2 C246.2 C247.2 C248.2 C249.2 C250.2 C251.2 C252.2 Q3.2(S) SJ3.1 U4.L9(DVDD18_IO)
VIO18_PMU: C133.2 U4.H2(AVDD18_AUD)
VMC: C202.2 U4.R9(VMC)
VS1: C199.2 C200.2 C201.2 U4.E4(VS1_LDO1)
VS2: C205.2 C206.2 U4.M14(VS2_LDO4) U4.N14(VS2_LDO2) U4.P13(VS2_LDO3)
VSYS: R122.2 U30.1(EN) U30.5(VCC)
VUSB_PMU: U4.N8(VUSB)
VAUD28: C131.2 U4.J3(AVDD28_AUD) U4.R5(VAUD28)
VIO_18: C84.2 Q3.3(D) SJ3.2 U4.F3(VIO18) ; port VIO18
NetC88_2: C88.2 U4.M8(VRTC28)
NetQ3_1: Q3.1(G) R122.1 U30.4(OUT)
NetR121_1: R121.1 R123.2 U30.3(IN)

Not connected (* = marked no-connect by the designer): U4 E6(VCAMIO)* F5(VRF18)* M3(AVDD18_AUXADC)* M6(VAUX18)* M9(VBIF28)* M10(VCAMA1)* M15(VCAMD)* N7(VSIM1)* N9(VIO28)* N10(VCAMA2)* N15(VRF12)* P8(VLDO28)* P10(VSIM2)* P11(VIBR)* P16(VRF12_S)* R7(VFE28)* R10(VMCH)*; U30 6(CDELAY)*

### Library data of the parts
Q3 = IRLML6344TRPBF: as Q1 on sheet BUCK
SJ3 = SJ: Để hở. hàn 2 đầu lại nếu cần
U4 = MT6358W_A: as U4 on sheet Power_Supply; Datasheet Link: https://www.mouser.com/catalog/specsheets/MediaTek_MTK_MT6358_Product_Brief_v1_0.pdf?_gl=1*14yevt7*_ga*OTAyMjU2NDU3LjE2ODExMDUyMzk.*_ga_1KQLCYKRX3*MTcwODA1NjU3MS4xMTcuMC4xNzA4MDU2NTczLjAuMC4w*_ga_15W4STQT4T*MTcwODA1NjU3Mi4xNzIuMC4xNzA4MDU2NTczLjU5LjAuMA..; Height: 0.66mm; Mouser Part Number: 840-MT6358W/A; Mouser Price/Stock: https://www.mouser.co.uk/ProductDetail/MediaTek/MT6358W-A?qs=Jm2GQyTW%2FbiK3FZkyfX0lQ%3D%3D
U30 = MAX16052AUT: as U31 on sheet BUCK